# EAGLE design Logger (EAGLE 7.3.0)

## Sheet 1 of 6
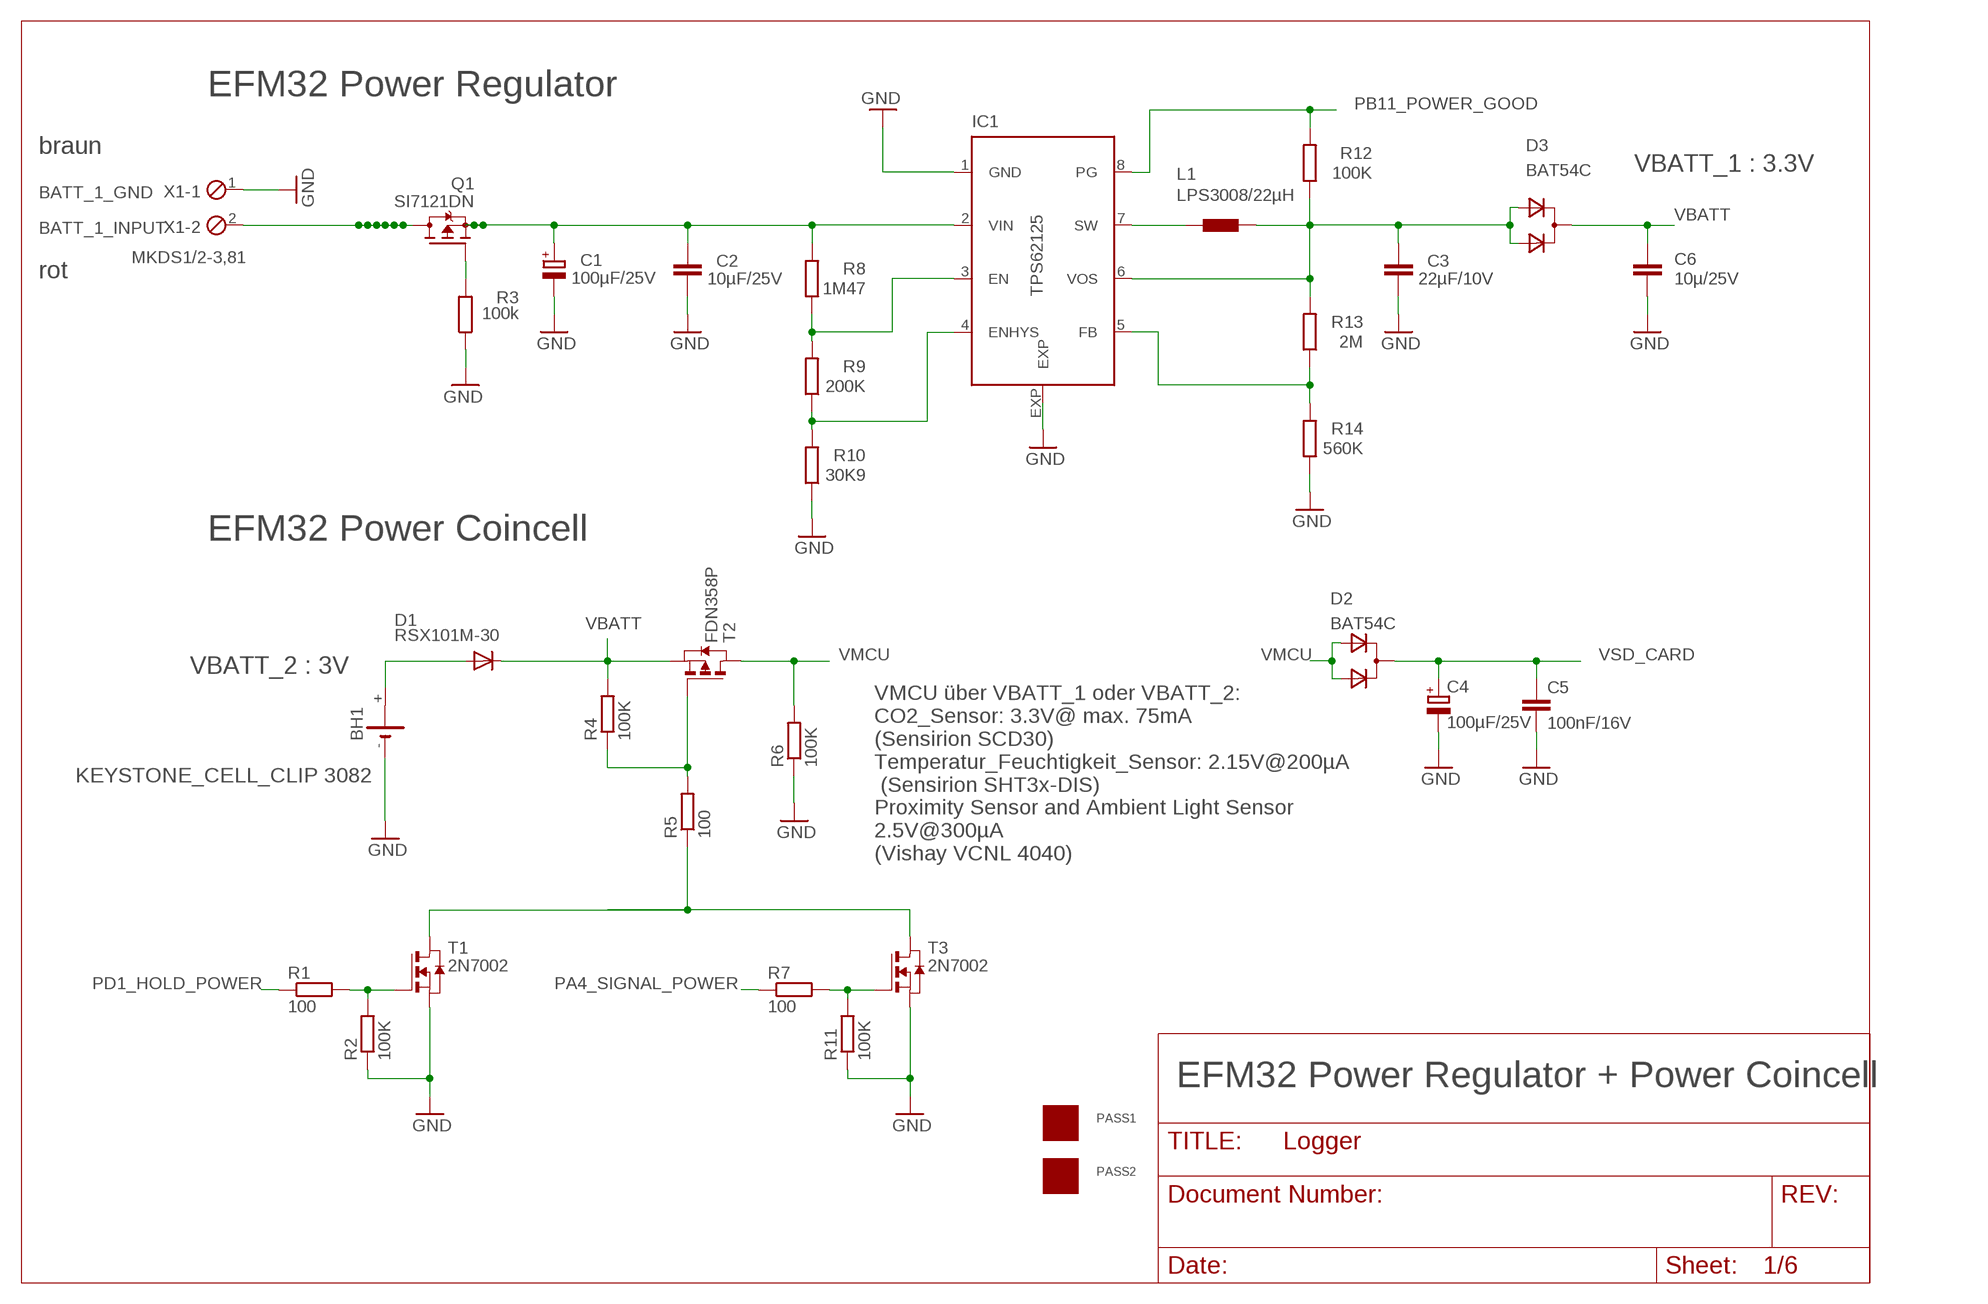
[diagram p0: schematic, sheet 1]

### Parts
BH1  KEYSTONE_CELL_CLIP 3082  3082  [3082]
C1  100µF/25V  CPOL-EUE  [PANASONIC_E]
C2  10µF/25V  C-EUC1206  [C1206]
C3  22µF/10V  C-EUC0603  [C0603]
C4  100µF/25V  CPOL-EUE  [PANASONIC_E]
C5  100nF/16V  C-EUC0805  [C0805]
C6  10µ/25V  C-EUC1206  [C1206]
D1  RSX101M-30  DIODE-SOD123  [SOD123]
D2  BAT54C  D2A_SOT23  [SOT-23$1]
D3  BAT54C  D2A_SOT23  [SOT-23$1]
IC1  TPS62125  [DSG_PWSO-N8_EXP]
L1  LPS3008/22µH  LPS3008  [LPS3008]
PASS1  ROUND_1MM1.5  [ROUND2_1.5MM]
PASS2  ROUND_1MM1.5  [ROUND2_1.5MM]
Q1  SI7121DN  TRANSISTOR-FET_SI7113DN  [TRANSISTOR-FET_1212-8S]
R1  100  R-EU_R0805  [R0805]
R2  100K  R-EU_R0805  [R0805]
R3  100k  R-EU_R0805  [R0805]
R4  100K  R-EU_R0805  [R0805]
R5  100  R-EU_R0805  [R0805]
R6  100K  R-EU_R0805  [R0805]
R7  100  R-EU_R0805  [R0805]
R8  1M47  R-EU_R0805  [R0805]
R9  200K  R-EU_R0805  [R0805]
R10  30K9  R-EU_R0805  [R0805]
R11  100K  R-EU_R0805  [R0805]
R12  100K  R-EU_R0805  [R0805]
R13  2M  R-EU_R0805  [R0805]
R14  560K  R-EU_R0805  [R0805]
T1  2N7002  NMOSSOT23  [SOT-23]
T2  FDN358P  ZETEX_PMOSSOT23  [ZETEX_SOT-23]
T3  2N7002  NMOSSOT23  [SOT-23]
X1  MKDS1/2-3,81  [2POL381]

### Nets
1: C3.1 D3.2(A1) D3.3(A2) IC1.6(VOS) L1.2 R12.1 R13.2
_: Q1.5(D) Q1.6(D) Q1.7(D) Q1.8(D) Q1.9(D) Q1.10(D) Q1.11(D) X1.2
BATT_INPUT: C1.+ C2.1 IC1.2(VIN) Q1.1(S) Q1.2(S) Q1.3(S) R8.2
GND: BH1.- C1.- C2.2 C3.2 C4.- C5.2 C6.1 IC1.1(GND) IC1.EXP R2.1 R3.1 R6.1 R10.1 R11.1 R14.1 T1.2(S) T3.2(S) X1.1 ; also sheet 2,3,4,5,6
N$2: R1.2 R2.2 T1.3(G)
N$5: IC1.3(EN) R8.1 R9.2
N$8: IC1.4(ENHYS) R9.1 R10.2
N$9: IC1.7(SW) L1.1
N$17: BH1.+ D1.A
N$20: Q1.4(G) R3.2
N$21: R4.1 R5.2 T2.3(G)
N$22: R7.2 R11.2 T3.3(G)
N$25: R5.1 T1.1(D) T3.1(D)
N$46: IC1.5(FB) R13.1 R14.2
PA4_SIGNAL_POWER: R7.1 ; also sheet 2,3
PB11_POWER_GOOD: IC1.8(PG) R12.2 ; also sheet 2
PD1_HOLD_POWER: R1.1 ; also sheet 2
VBATT: C6.2 D1.C D3.1(C) R4.2 T2.2(S) ; also sheet 3
VMCU: D2.2(A1) D2.3(A2) R6.2 T2.1(D) ; also sheet 2,3,5,6
VSD_CARD: C4.+ C5.1 D2.1(C) ; also sheet 4
Unconnected: BH1.+1(+)

### Notes on the sheet
- EFM32 Power Regulator
- braun
- VBATT_1 : 3.3V
- BATT_1_GND
- BATT_1_INPUT
- rot
- EFM32 Power Coincell
- VBATT_2 : 3V
- VMCU über VBATT_1 oder VBATT_2:
  CO2_Sensor: 3.3V@ max. 75mA
  (Sensirion SCD30)
  Temperatur_Feuchtigkeit_Sensor: 2.15V@200µA
   (Sensirion SHT3x-DIS)
  Proximity Sensor and Ambient Light Sensor
  2.5V@300µA
  (Vishay VCNL 4040)
- EFM32 Power Regulator + Power Coincell

## Sheet 2 of 6
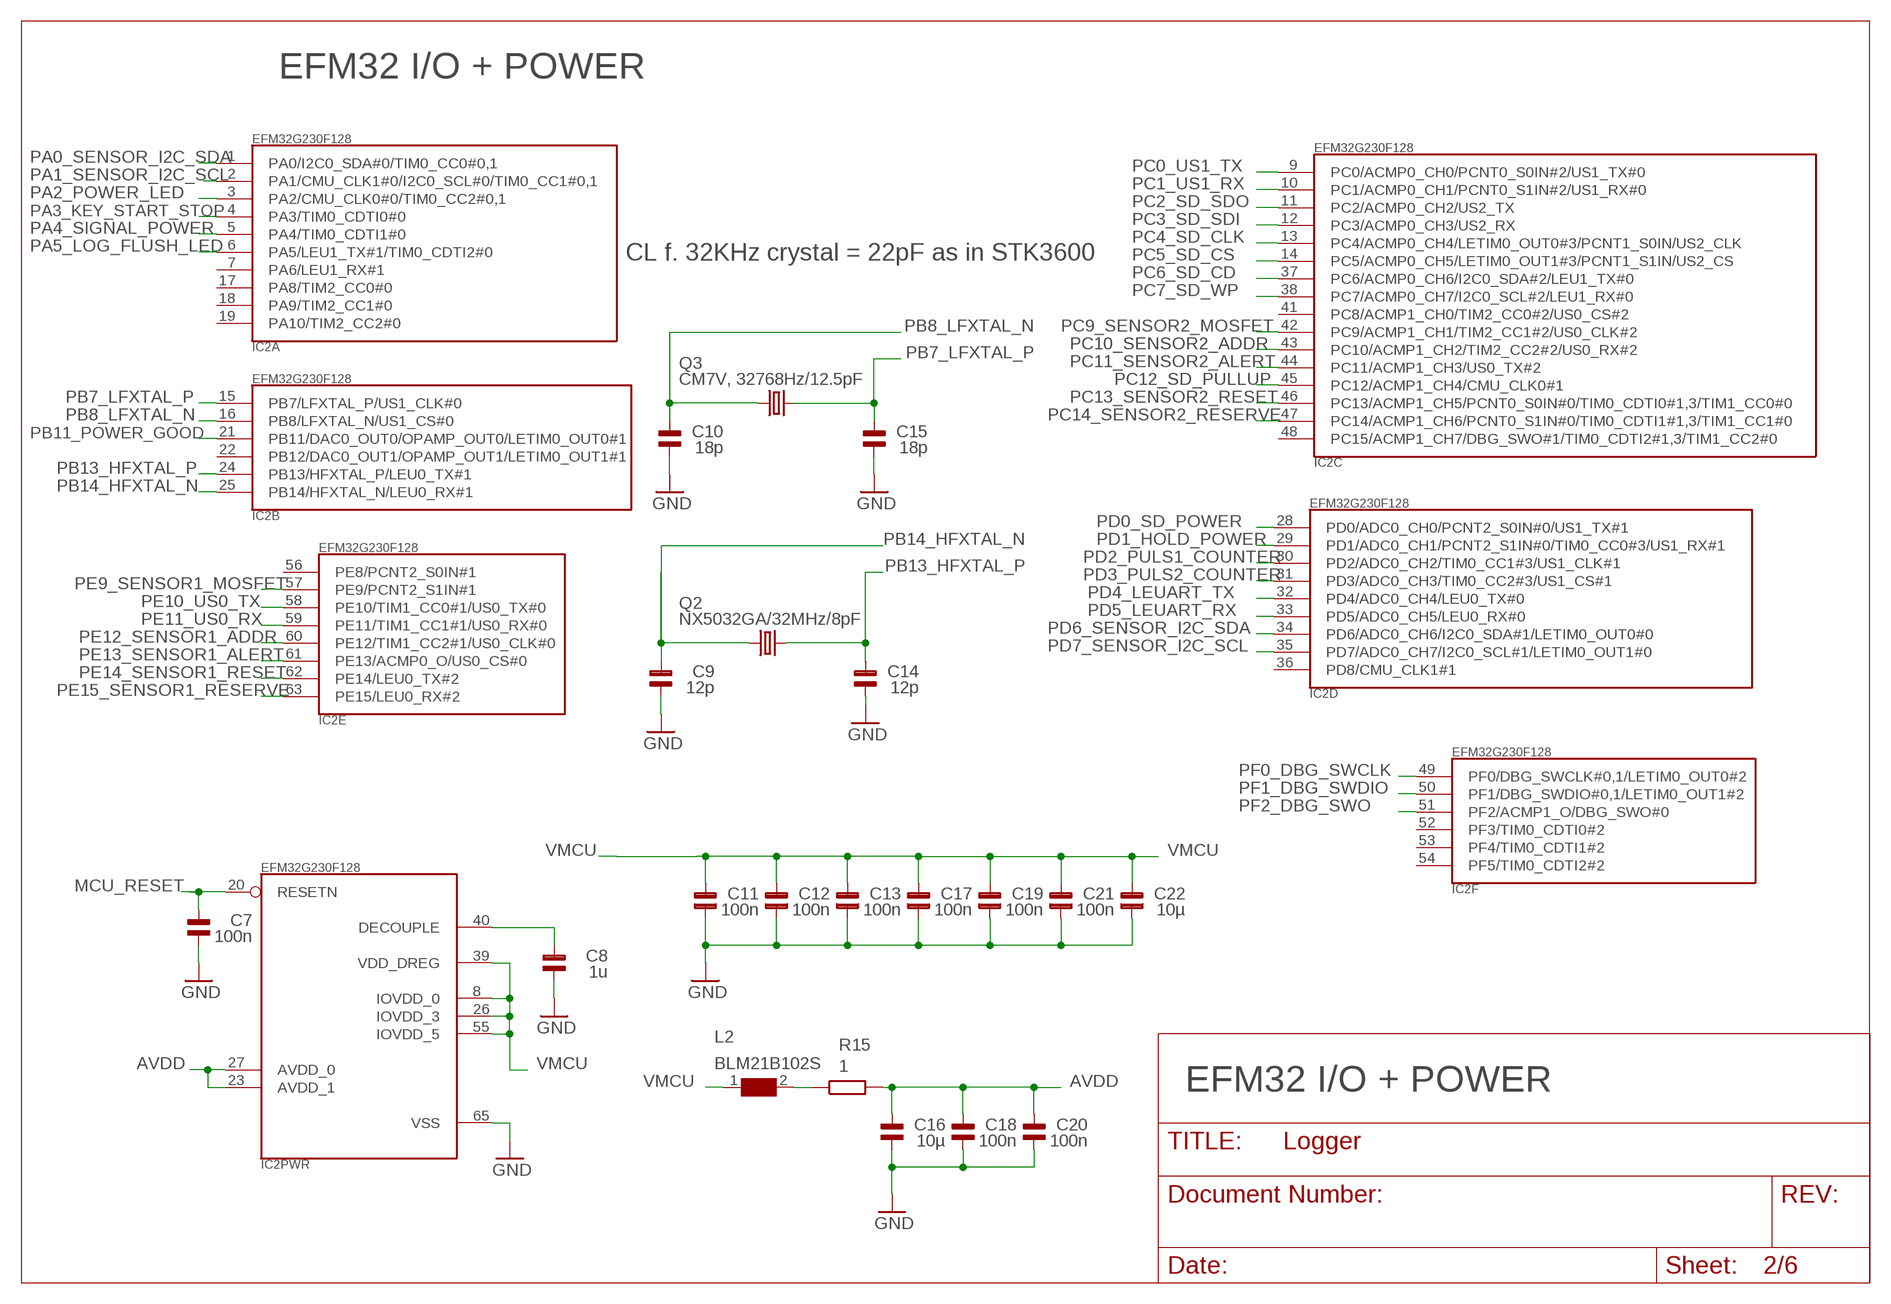
[diagram p1: schematic, sheet 2]

### Parts
C7  100n  C_SMD0805  [0805]
C8  1u  C_SMD0805  [0805]
C9  12p  C_SMD0805  [0805]
C10  18p  C_SMD0805  [0805]
C11  100n  C_SMD0805  [0805]
C12  100n  C_SMD0805  [0805]
C13  100n  C_SMD0805  [0805]
C14  12p  C_SMD0805  [0805]
C15  18p  C_SMD0805  [0805]
C16  10µ  C_SMD0805  [0805]
C17  100n  C_SMD0805  [0805]
C18  100n  C_SMD0805  [0805]
C19  100n  C_SMD0805  [0805]
C20  100n  C_SMD0805  [0805]
C21  100n  C_SMD0805  [0805]
C22  10µ  C_SMD0805  [0805]
IC2  EFM32G230F128  [QFN64]
L2  BLM21B102S  WE-CBF-7427920_0805  [0805]
Q2  NX5032GA/32MHz/8pF  CRYSTAL2P5.0X3.2  [CRYSTAL2P5.0X3.2]
Q3  CM7V, 32768Hz/12.5pF  CRYSTAL2P  [CRYSTAL2P3.2X1.5]
R15  1  R-EU_R0805  [R0805]

### Nets
AVDD [VCC]: C16.2 C18.2 C20.2 IC2.23(PWR:AVDD_1) IC2.27(PWR:AVDD_0) R15.2
GND: C7.1 C8.1 C9.1 C10.1 C11.1 C12.1 C13.1 C14.1 C15.1 C16.1 C17.1 C18.1 C19.1 C20.1 C21.1 C22.1 IC2.65(PWR:VSS) ; also sheet 1,3,4,5,6
MCU_RESET: C7.2 IC2.20(PWR:RESETN) ; also sheet 3
N$14: L2.2 R15.1
N$30: C8.2 IC2.40(PWR:DECOUPLE)
PA0_SENSOR_I2C_SDA: IC2.1(A:PA0/I2C0_SDA#0/TIM0_CC0#0,1) ; also sheet 5
PA1_SENSOR_I2C_SCL: IC2.2(A:PA1/CMU_CLK1#0/I2C0_SCL#0/TIM0_CC1#0,1) ; also sheet 5
PA2_POWER_LED: IC2.3(A:PA2/CMU_CLK0#0/TIM0_CC2#0,1) ; also sheet 3
PA3_KEY_START_STOP: IC2.4(A:PA3/TIM0_CDTI0#0) ; also sheet 3
PA4_SIGNAL_POWER: IC2.5(A:PA4/TIM0_CDTI1#0) ; also sheet 1,3
PA5_LOG_FLUSH_LED: IC2.6(A:PA5/LEU1_TX#1/TIM0_CDTI2#0) ; also sheet 3
PB7_LFXTAL_P: C15.2 IC2.15(B:PB7/LFXTAL_P/US1_CLK#0) Q3.2
PB8_LFXTAL_N: C10.2 IC2.16(B:PB8/LFXTAL_N/US1_CS#0) Q3.1
PB11_POWER_GOOD: IC2.21(B:PB11/DAC0_OUT0/OPAMP_OUT0/LETIM0_OUT0#1) ; also sheet 1
PB13_HFXTAL_P: C14.2 IC2.24(B:PB13/HFXTAL_P/LEU0_TX#1) Q2.2
PB14_HFXTAL_N: C9.2 IC2.25(B:PB14/HFXTAL_N/LEU0_RX#1) Q2.1
PC0_US1_TX: IC2.9(C:PC0/ACMP0_CH0/PCNT0_S0IN#2/US1_TX#0) ; also sheet 4
PC1_US1_RX: IC2.10(C:PC1/ACMP0_CH1/PCNT0_S1IN#2/US1_RX#0) ; also sheet 4
PC2_SD_SDO: IC2.11(C:PC2/ACMP0_CH2/US2_TX) ; also sheet 4
PC3_SD_SDI: IC2.12(C:PC3/ACMP0_CH3/US2_RX) ; also sheet 4
PC4_SD_CLK: IC2.13(C:PC4/ACMP0_CH4/LETIM0_OUT0#3/PCNT1_S0IN/US2_CLK) ; also sheet 4
PC5_SD_CS: IC2.14(C:PC5/ACMP0_CH5/LETIM0_OUT1#3/PCNT1_S1IN/US2_CS) ; also sheet 4
PC6_SD_CD: IC2.37(C:PC6/ACMP0_CH6/I2C0_SDA#2/LEU1_TX#0) ; also sheet 4
PC7_SD_WP: IC2.38(C:PC7/ACMP0_CH7/I2C0_SCL#2/LEU1_RX#0) ; also sheet 4
PC9_SENSOR2_MOSFET: IC2.42(C:PC9/ACMP1_CH1/TIM2_CC1#2/US0_CLK#2) ; also sheet 5
PC10_SENSOR2_ADDR: IC2.43(C:PC10/ACMP1_CH2/TIM2_CC2#2/US0_RX#2) ; also sheet 5
PC11_SENSOR2_ALERT: IC2.44(C:PC11/ACMP1_CH3/US0_TX#2) ; also sheet 5
PC12_SD_PULLUP: IC2.45(C:PC12/ACMP1_CH4/CMU_CLK0#1) ; also sheet 4
PC13_SENSOR2_RESET: IC2.46(C:PC13/ACMP1_CH5/PCNT0_S0IN#0/TIM0_CDTI0#1,3/TIM1_CC0#0) ; also sheet 5
PC14_SENSOR2_RESERVE: IC2.47(C:PC14/ACMP1_CH6/PCNT0_S1IN#0/TIM0_CDTI1#1,3/TIM1_CC1#0) ; also sheet 5
PD0_SD_POWER: IC2.28(D:PD0/ADC0_CH0/PCNT2_S0IN#0/US1_TX#1) ; also sheet 4
PD1_HOLD_POWER: IC2.29(D:PD1/ADC0_CH1/PCNT2_S1IN#0/TIM0_CC0#3/US1_RX#1) ; also sheet 1
PD2_PULS1_COUNTER: IC2.30(D:PD2/ADC0_CH2/TIM0_CC1#3/US1_CLK#1) ; also sheet 6
PD3_PULS2_COUNTER: IC2.31(D:PD3/ADC0_CH3/TIM0_CC2#3/US1_CS#1) ; also sheet 6
PD4_LEUART_TX: IC2.32(D:PD4/ADC0_CH4/LEU0_TX#0) ; also sheet 4
PD5_LEUART_RX: IC2.33(D:PD5/ADC0_CH5/LEU0_RX#0) ; also sheet 4
PD6_SENSOR_I2C_SDA: IC2.34(D:PD6/ADC0_CH6/I2C0_SDA#1/LETIM0_OUT0#0) ; also sheet 5
PD7_SENSOR_I2C_SCL: IC2.35(D:PD7/ADC0_CH7/I2C0_SCL#1/LETIM0_OUT1#0) ; also sheet 5
PE9_SENSOR1_MOSFET: IC2.57(E:PE9/PCNT2_S1IN#1) ; also sheet 5
PE10_US0_TX: IC2.58(E:PE10/TIM1_CC0#1/US0_TX#0) ; also sheet 4
PE11_US0_RX: IC2.59(E:PE11/TIM1_CC1#1/US0_RX#0) ; also sheet 4
PE12_SENSOR1_ADDR: IC2.60(E:PE12/TIM1_CC2#1/US0_CLK#0) ; also sheet 5
PE13_SENSOR1_ALERT: IC2.61(E:PE13/ACMP0_O/US0_CS#0) ; also sheet 5
PE14_SENSOR1_RESET: IC2.62(E:PE14/LEU0_TX#2) ; also sheet 5
PE15_SENSOR1_RESERVE: IC2.63(E:PE15/LEU0_RX#2) ; also sheet 5
PF0_DBG_SWCLK: IC2.49(F:PF0/DBG_SWCLK#0,1/LETIM0_OUT0#2) ; also sheet 3
PF1_DBG_SWDIO: IC2.50(F:PF1/DBG_SWDIO#0,1/LETIM0_OUT1#2) ; also sheet 3
PF2_DBG_SWO: IC2.51(F:PF2/ACMP1_O/DBG_SWO#0) ; also sheet 3
VMCU: C11.2 C12.2 C13.2 C17.2 C19.2 C21.2 C22.2 IC2.8(PWR:IOVDD_0) IC2.26(PWR:IOVDD_3) IC2.39(PWR:VDD_DREG) IC2.55(PWR:IOVDD_5) L2.1 ; also sheet 1,3,5,6
Unconnected: IC2.7(A:PA6/LEU1_RX#1) IC2.17(A:PA8/TIM2_CC0#0) IC2.18(A:PA9/TIM2_CC1#0) IC2.19(A:PA10/TIM2_CC2#0) IC2.22(B:PB12/DAC0_OUT1/OPAMP_OUT1/LETIM0_OUT1#1) IC2.36(D:PD8/CMU_CLK1#1) IC2.41(C:PC8/ACMP1_CH0/TIM2_CC0#2/US0_CS#2) IC2.48(C:PC15/ACMP1_CH7/DBG_SWO#1/TIM0_CDTI2#1,3/TIM1_CC2#0) IC2.52(F:PF3/TIM0_CDTI0#2) IC2.53(F:PF4/TIM0_CDTI1#2) IC2.54(F:PF5/TIM0_CDTI2#2) IC2.56(E:PE8/PCNT2_S0IN#1)

### Notes on the sheet
- EFM32 I/O + POWER
- CL f. 32KHz crystal = 22pF as in STK3600
- EFM32 I/O + POWER

## Sheet 3 of 6
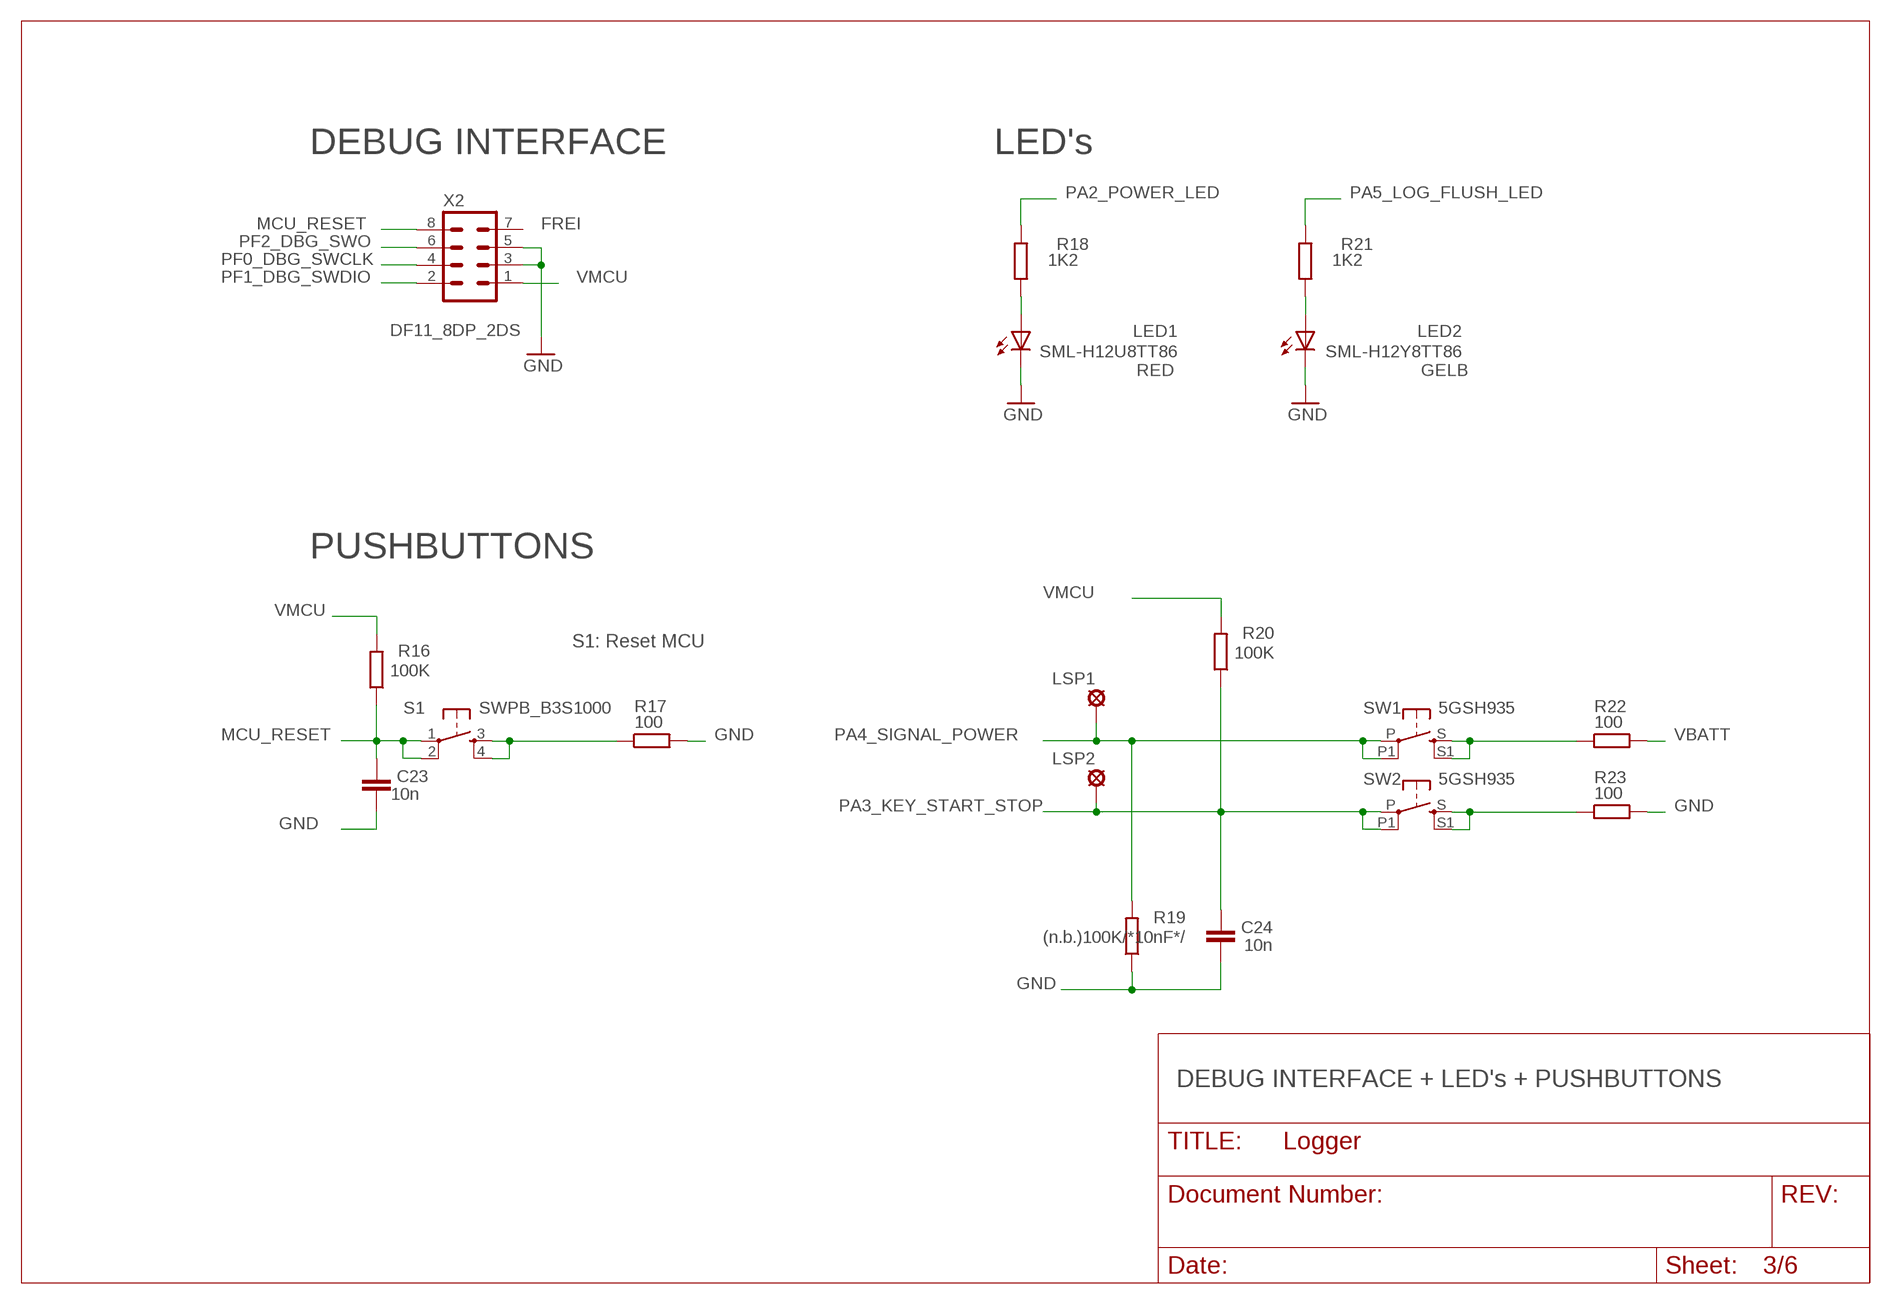
[diagram p2: schematic, sheet 3]

### Parts
C23  10n  C-EUC0603  [C0603]
C24  10n  C-EUC0603K  [C0603K]
LED1  SML-H12U8TT86  LEDCHIPLED_0805  [CHIPLED_0805]
LED2  SML-H12Y8TT86  LEDCHIPLED_0805  [CHIPLED_0805]
LSP1  (n.b.)SE13  SE13  [SE13]
LSP2  (n.b.)SE13  SE13  [SE13]
R16  100K  R-EU_R0805  [R0805]
R17  100  R-EU_R0805  [R0805]
R18  1K2  R-EU_R0805  [R0805]
R19  (n.b.)100K/*10nF*/  R-EU_R0805  [R0805]
R20  100K  R-EU_R0805  [R0805]
R21  1K2  R-EU_R0805  [R0805]
R22  100  R-EU_R0805  [R0805]
R23  100  R-EU_R0805  [R0805]
S1  SWPB_B3S1000  DTSM-6  [DTSM-6]
SW1  5GSH935  [MULTIMEC_5GSH935]
SW2  5GSH935  [MULTIMEC_5GSH935]
X2  DF11_8DP_2DS  DP11_8DP_2DS  [DP11_8DP-2DS]

### Nets
GND: C23.1 C24.1 LED1.C LED2.C R17.2 R19.1 R23.2 X2.3 X2.5 ; also sheet 1,2,4,5,6
MCU_RESET: C23.2 R16.1 S1.1 S1.2 X2.8 ; also sheet 2
N$15: LED1.A R18.2
N$16: LED2.A R21.2
N$26: R17.1 S1.3 S1.4
N$27: R23.1 SW2.S SW2.S1
N$29: R22.1 SW1.S SW1.S1
PA2_POWER_LED: R18.1 ; also sheet 2
PA3_KEY_START_STOP: C24.2 LSP2.MP R20.1 SW2.P SW2.P1 ; also sheet 2
PA4_SIGNAL_POWER: LSP1.MP R19.2 SW1.P SW1.P1 ; also sheet 1,2
PA5_LOG_FLUSH_LED: R21.1 ; also sheet 2
PF0_DBG_SWCLK: X2.4 ; also sheet 2
PF1_DBG_SWDIO: X2.2 ; also sheet 2
PF2_DBG_SWO: X2.6 ; also sheet 2
VBATT: R22.2 ; also sheet 1
VMCU: R16.2 R20.2 X2.1 ; also sheet 1,2,5,6
Unconnected: X2.7

### Notes on the sheet
- DEBUG INTERFACE | LED's
- FREI
- RED | GELB
- PUSHBUTTONS
- S1: Reset MCU
- DEBUG INTERFACE + LED's + PUSHBUTTONS

## Sheet 4 of 6
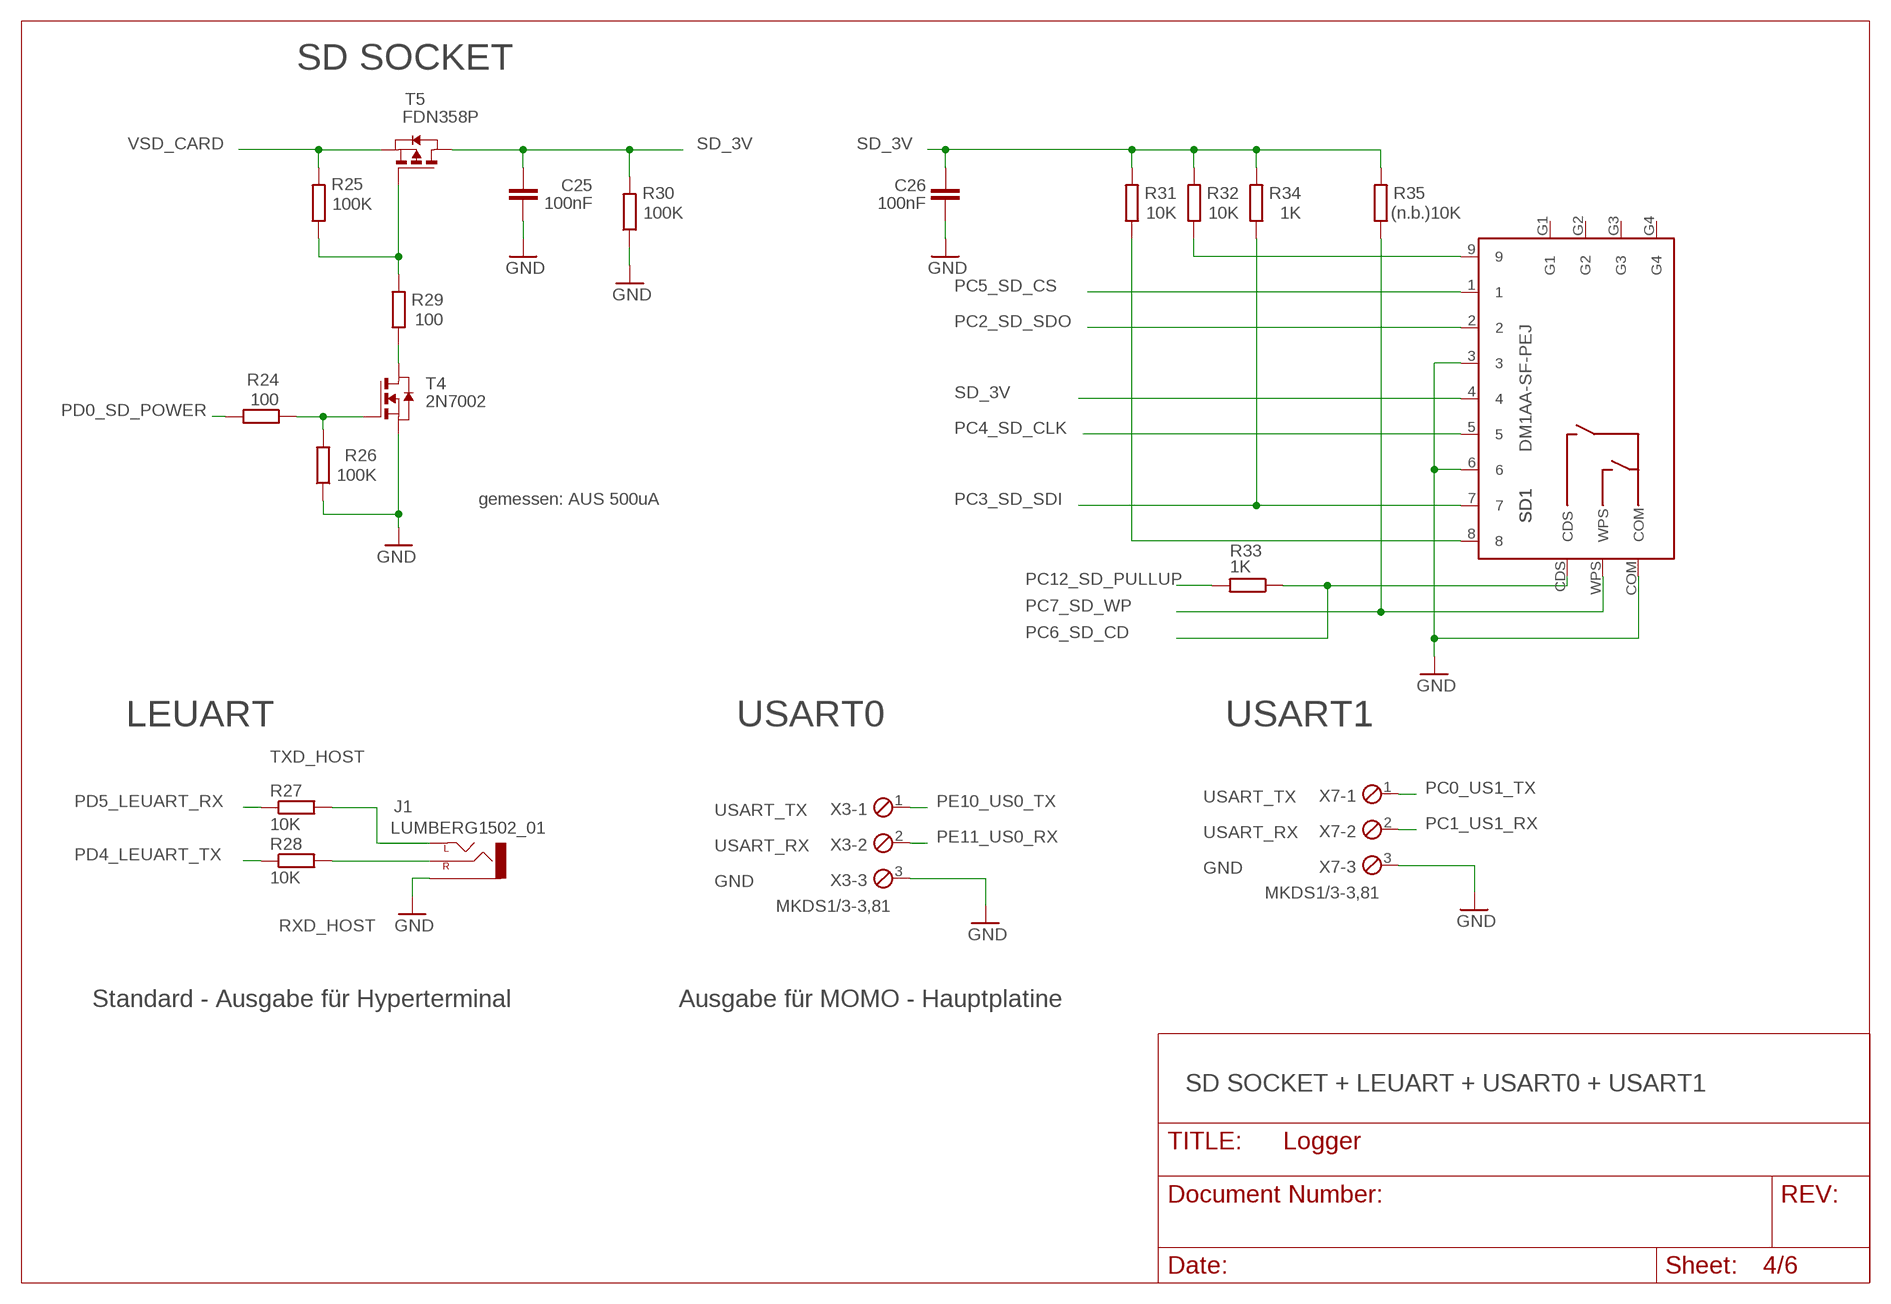
[diagram p3: schematic, sheet 4]

### Parts
C25  100nF  C-EUC0603  [C0603]
C26  100nF  C-EUC0603  [C0603]
J1  LUMBERG1502_01  [LUMBERG1502_01]
R24  100  R-EU_R0805  [R0805]
R25  100K  R-EU_R0805  [R0805]
R26  100K  R-EU_R0805  [R0805]
R27  10K  R-EU_R0805  [R0805]
R28  10K  R-EU_R0805  [R0805]
R29  100  R-EU_R0805  [R0805]
R30  100K  R-EU_R0805  [R0805]
R31  10K  R-EU_R0805  [R0805]
R32  10K  R-EU_R0805  [R0805]
R33  1K  R-EU_R0805  [R0805]
R34  1K  R-EU_R0805  [R0805]
R35  (n.b.)10K  R-EU_R0805  [R0805]
SD1  DM1AA-SF-PEJ  [DM1AA-SF-PEJ]
T4  2N7002  ZETEX_NMOSSOT23  [ZETEX_SOT-23]
T5  FDN358P  ZETEX_PMOSSOT23  [ZETEX_SOT-23]
X3  MKDS1/3-3,81  [3POL381]
X7  MKDS1/3-3,81  [3POL381]

### Nets
GND: C25.2 C26.2 J1.P$1(1-SLEEVE) R26.1 R30.1 SD1.3 SD1.6 SD1.COM T4.2(S) X3.3 X7.3 ; also sheet 1,2,3,5,6
N$4: R25.1 R29.2 T5.3(G)
N$6: R29.1 T4.1(D)
N$7: R24.1 R26.2 T4.3(G)
N$19: R32.1 SD1.9
N$23: R31.1 SD1.8
PC0_US1_TX: X7.1 ; also sheet 2
PC1_US1_RX: X7.2 ; also sheet 2
PC2_SD_SDO: SD1.2 ; also sheet 2
PC3_SD_SDI: R34.1 SD1.7 ; also sheet 2
PC4_SD_CLK: SD1.5 ; also sheet 2
PC5_SD_CS: SD1.1 ; also sheet 2
PC6_SD_CD: R33.1 SD1.CDS ; also sheet 2
PC7_SD_WP: R35.1 SD1.WPS ; also sheet 2
PC12_SD_PULLUP: R33.2 ; also sheet 2
PD0_SD_POWER: R24.2 ; also sheet 2
PD4_LEUART_TX: R28.1 ; also sheet 2
PD5_LEUART_RX: R27.1 ; also sheet 2
PE10_US0_TX: X3.1 ; also sheet 2
PE11_US0_RX: X3.2 ; also sheet 2
RXD_HOST: J1.P$3(3-RIGHT) R28.2
SD_3V: C25.1 C26.1 R30.2 R31.2 R32.2 R34.2 R35.2 SD1.4 T5.1(D)
TXD_HOST: J1.P$2(2-LEFT) R27.2
VSD_CARD: R25.2 T5.2(S) ; also sheet 1
Unconnected: SD1.G1 SD1.G2 SD1.G3 SD1.G4

### Notes on the sheet
- SD SOCKET
- gemessen: AUS 500uA
- LEUART | USART0 | USART1
- USART_TX
- USART_TX
- USART_RX
- USART_RX
- GND
- GND
- Standard - Ausgabe für Hyperterminal | Ausgabe für MOMO - Hauptplatine
- SD SOCKET + LEUART + USART0 + USART1

## Sheet 5 of 6
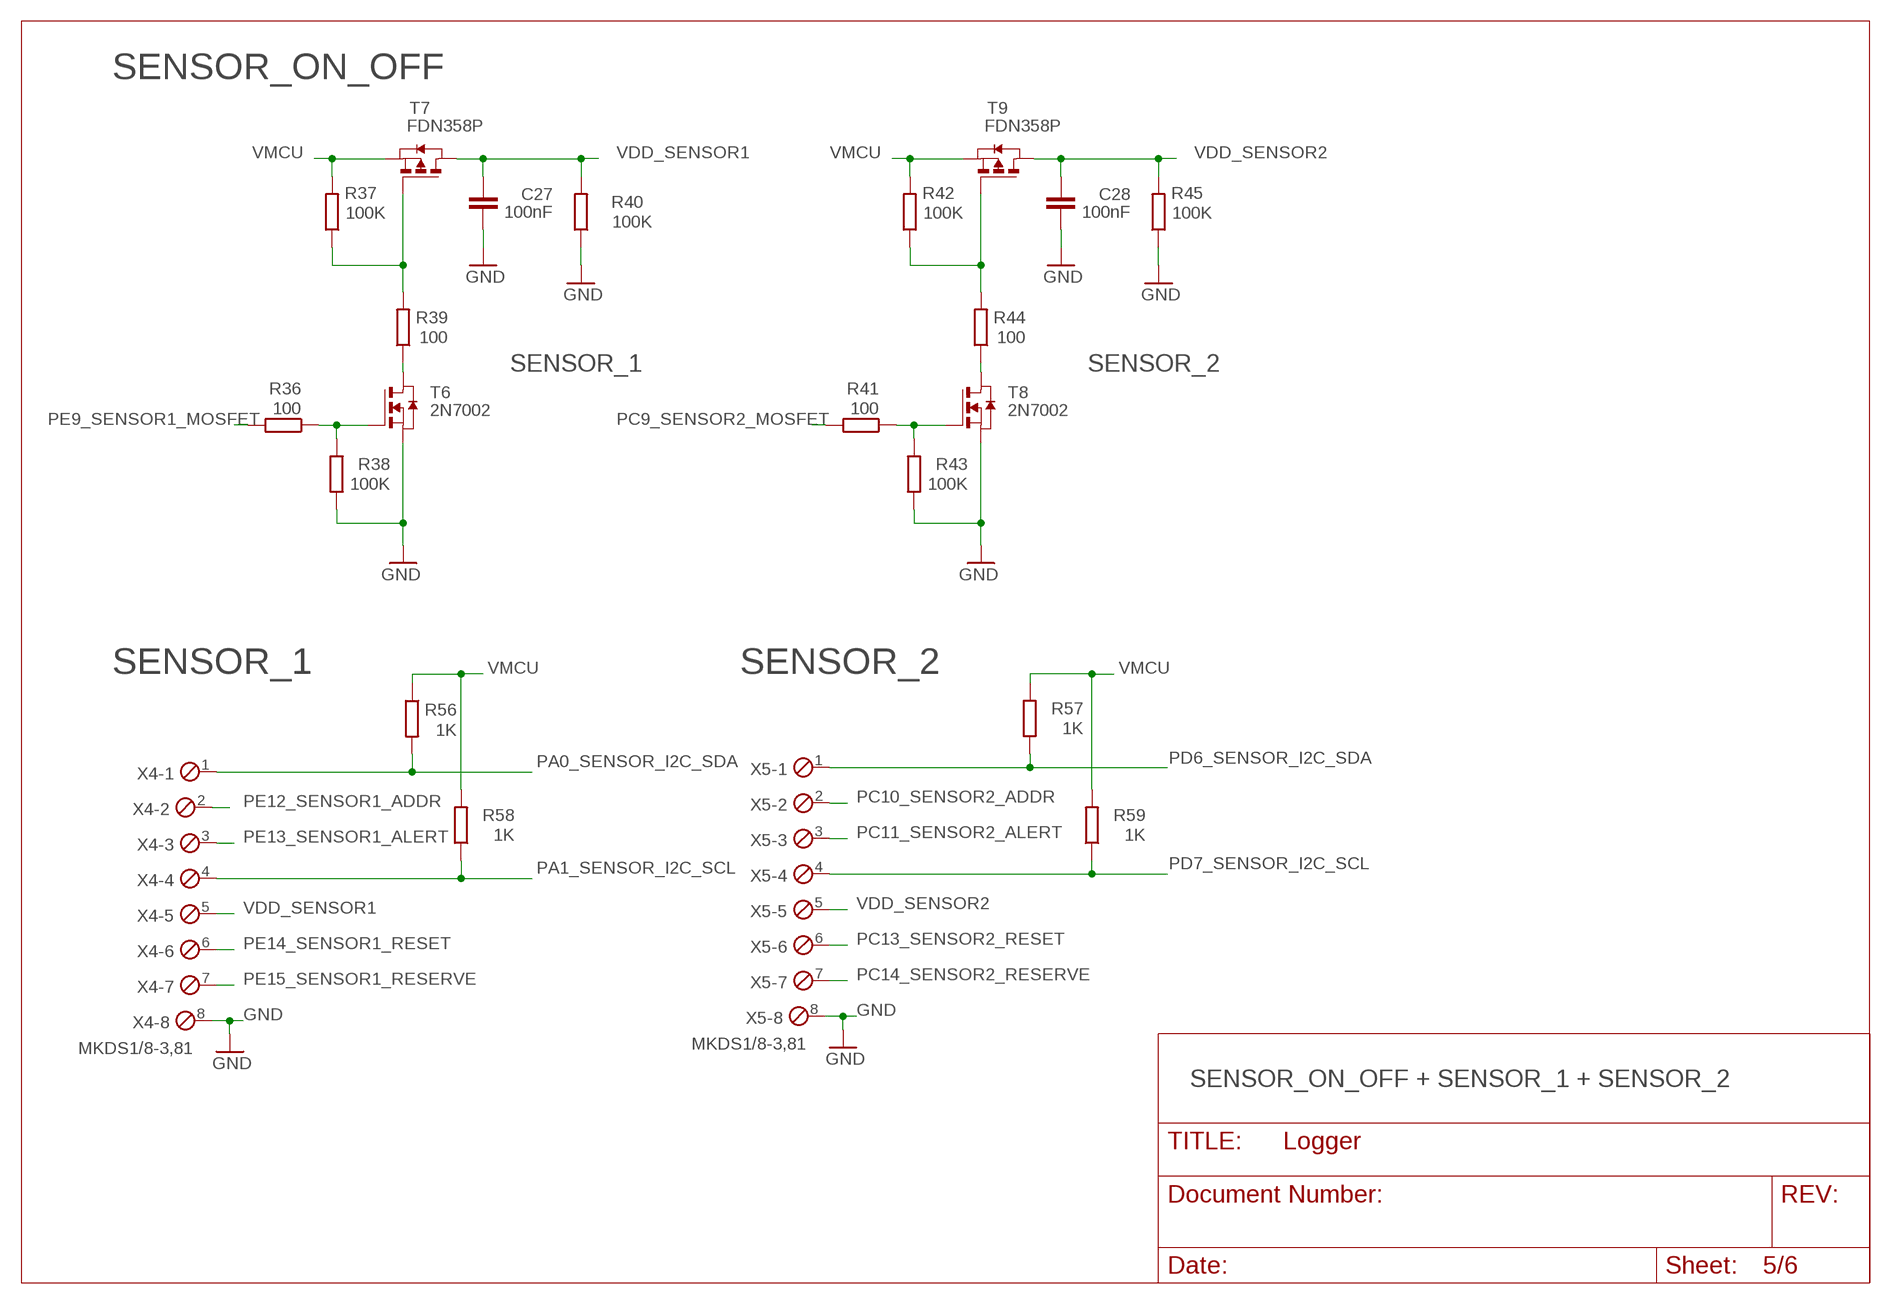
[diagram p4: schematic, sheet 5]

### Parts
C27  100nF  C-EUC0603  [C0603]
C28  100nF  C-EUC0603  [C0603]
R36  100  R-EU_R0805  [R0805]
R37  100K  R-EU_R0805  [R0805]
R38  100K  R-EU_R0805  [R0805]
R39  100  R-EU_R0805  [R0805]
R40  100K  R-EU_R0805  [R0805]
R41  100  R-EU_R0805  [R0805]
R42  100K  R-EU_R0805  [R0805]
R43  100K  R-EU_R0805  [R0805]
R44  100  R-EU_R0805  [R0805]
R45  100K  R-EU_R0805  [R0805]
R56  1K  R-EU_R0805  [R0805]
R57  1K  R-EU_R0805  [R0805]
R58  1K  R-EU_R0805  [R0805]
R59  1K  R-EU_R0805  [R0805]
T6  2N7002  ZETEX_NMOSSOT23  [ZETEX_SOT-23]
T7  FDN358P  ZETEX_PMOSSOT23  [ZETEX_SOT-23]
T8  2N7002  ZETEX_NMOSSOT23  [ZETEX_SOT-23]
T9  FDN358P  ZETEX_PMOSSOT23  [ZETEX_SOT-23]
X4  MKDS1/8-3,81  [8POL381]
X5  MKDS1/8-3,81  [8POL381]

### Nets
GND: C27.2 C28.2 R38.1 R40.1 R43.1 R45.1 T6.2(S) T8.2(S) X4.8 X5.8 ; also sheet 1,2,3,4,6
N$3: R37.1 R39.2 T7.3(G)
N$10: R39.1 T6.1(D)
N$11: R36.1 R38.2 T6.3(G)
N$12: R42.1 R44.2 T9.3(G)
N$13: R44.1 T8.1(D)
N$18: R41.1 R43.2 T8.3(G)
PA0_SENSOR_I2C_SDA: R56.2 X4.1 ; also sheet 2
PA1_SENSOR_I2C_SCL: R58.1 X4.4 ; also sheet 2
PC9_SENSOR2_MOSFET: R41.2 ; also sheet 2
PC10_SENSOR2_ADDR: X5.2 ; also sheet 2
PC11_SENSOR2_ALERT: X5.3 ; also sheet 2
PC13_SENSOR2_RESET: X5.6 ; also sheet 2
PC14_SENSOR2_RESERVE: X5.7 ; also sheet 2
PD6_SENSOR_I2C_SDA: R57.1 X5.1 ; also sheet 2
PD7_SENSOR_I2C_SCL: R59.1 X5.4 ; also sheet 2
PE9_SENSOR1_MOSFET: R36.2 ; also sheet 2
PE12_SENSOR1_ADDR: X4.2 ; also sheet 2
PE13_SENSOR1_ALERT: X4.3 ; also sheet 2
PE14_SENSOR1_RESET: X4.6 ; also sheet 2
PE15_SENSOR1_RESERVE: X4.7 ; also sheet 2
VDD_SENSOR1: C27.1 R40.2 T7.1(D) X4.5
VDD_SENSOR2: C28.1 R45.2 T9.1(D) X5.5
VMCU: R37.2 R42.2 R56.1 R57.2 R58.2 R59.2 T7.2(S) T9.2(S) ; also sheet 1,2,3,6

### Notes on the sheet
- SENSOR_ON_OFF
- SENSOR_1 | SENSOR_2
- SENSOR_1 | SENSOR_2
- SENSOR_ON_OFF + SENSOR_1 + SENSOR_2

## Sheet 6 of 6
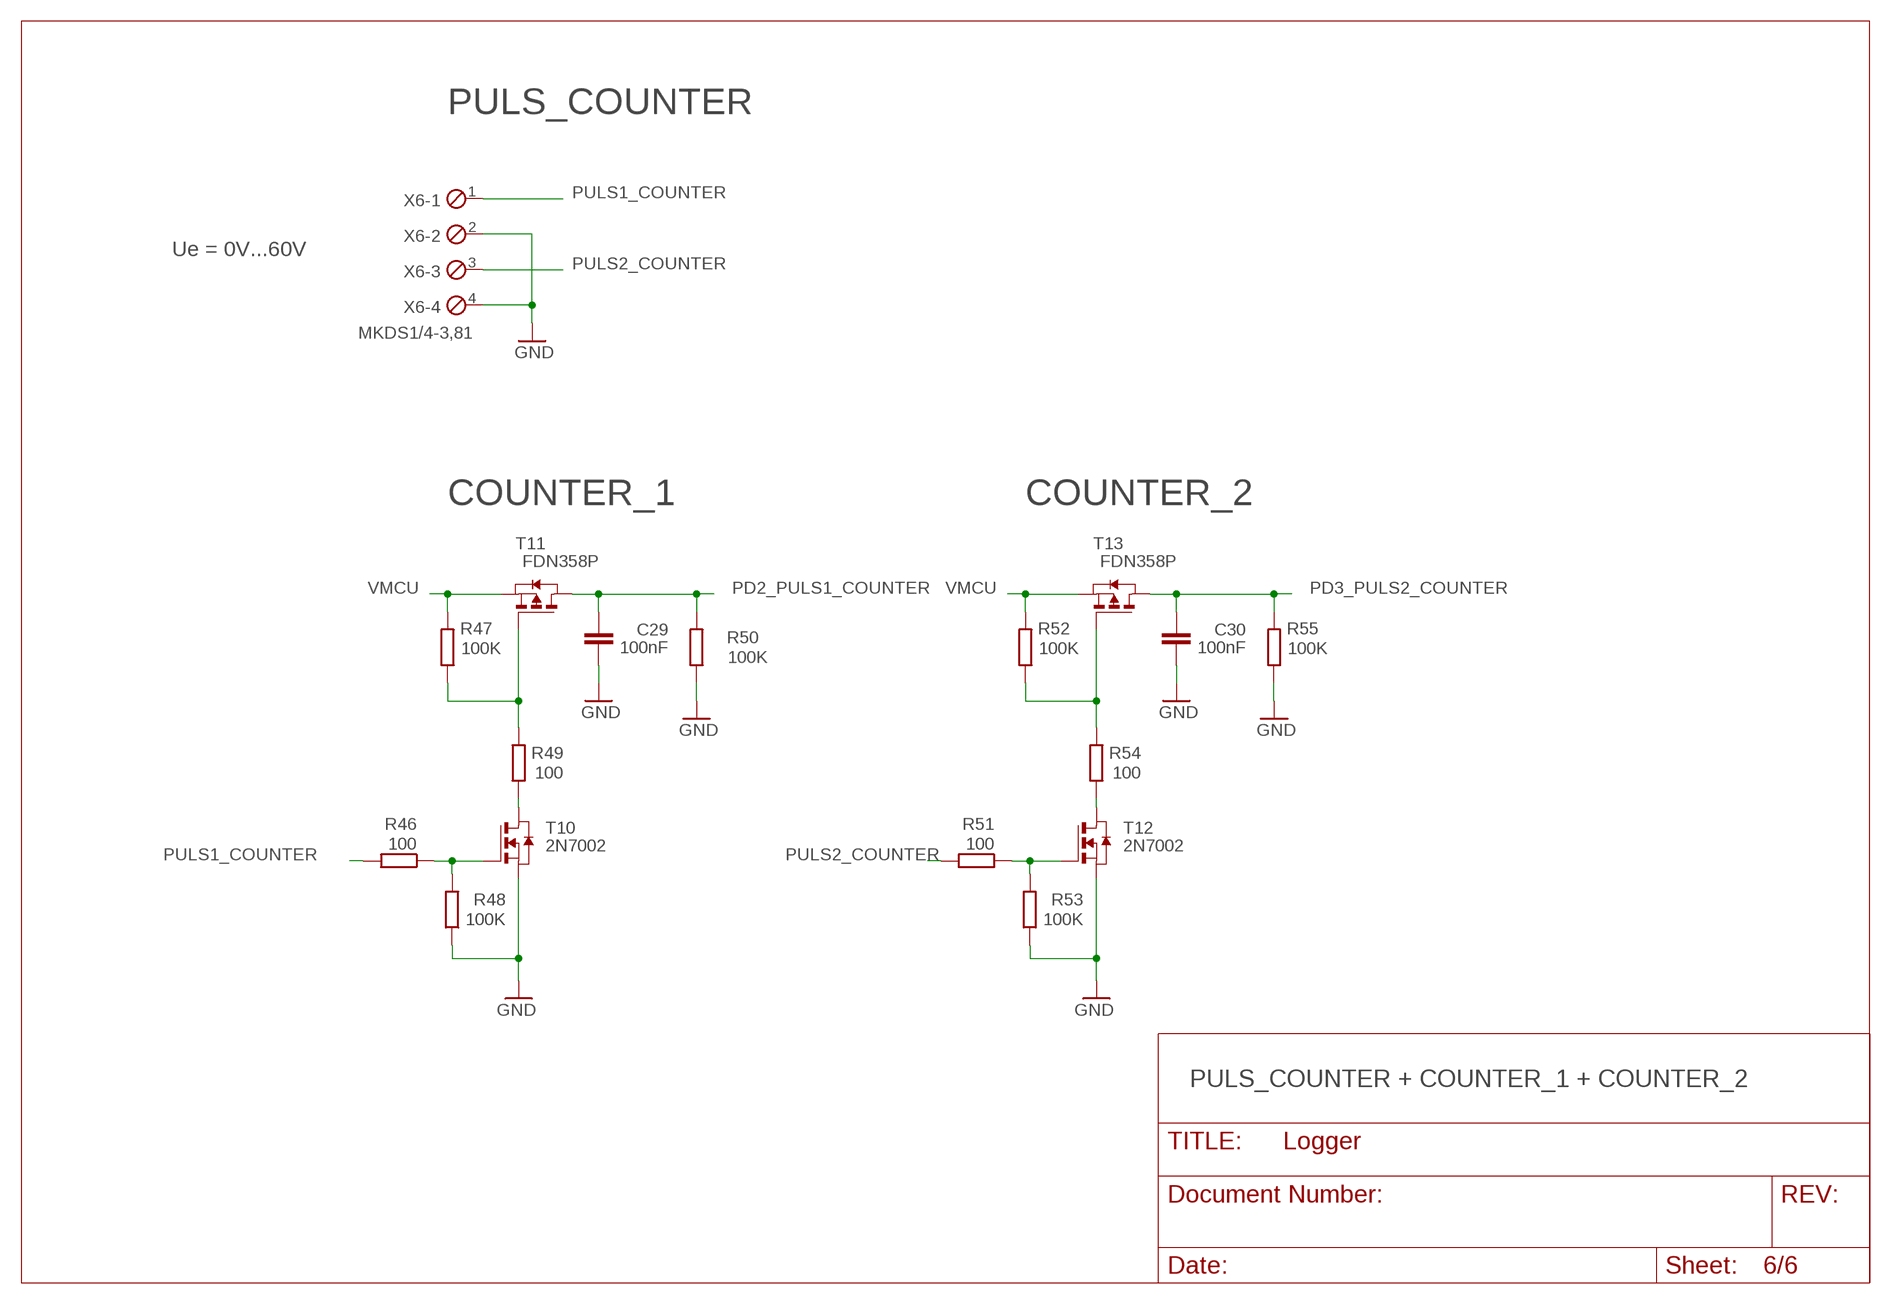
[diagram p5: schematic, sheet 6]

### Parts
C29  100nF  C-EUC0603  [C0603]
C30  100nF  C-EUC0603  [C0603]
R46  100  R-EU_R0805  [R0805]
R47  100K  R-EU_R0805  [R0805]
R48  100K  R-EU_R0805  [R0805]
R49  100  R-EU_R0805  [R0805]
R50  100K  R-EU_R0805  [R0805]
R51  100  R-EU_R0805  [R0805]
R52  100K  R-EU_R0805  [R0805]
R53  100K  R-EU_R0805  [R0805]
R54  100  R-EU_R0805  [R0805]
R55  100K  R-EU_R0805  [R0805]
T10  2N7002  ZETEX_NMOSSOT23  [ZETEX_SOT-23]
T11  FDN358P  ZETEX_PMOSSOT23  [ZETEX_SOT-23]
T12  2N7002  ZETEX_NMOSSOT23  [ZETEX_SOT-23]
T13  FDN358P  ZETEX_PMOSSOT23  [ZETEX_SOT-23]
X6  MKDS1/4-3,81  [4POL381]

### Nets
GND: C29.2 C30.2 R48.1 R50.1 R53.1 R55.1 T10.2(S) T12.2(S) X6.2 X6.4 ; also sheet 1,2,3,4,5
N$24: R47.1 R49.2 T11.3(G)
N$28: R49.1 T10.1(D)
N$31: R46.1 R48.2 T10.3(G)
N$32: R52.1 R54.2 T13.3(G)
N$33: R54.1 T12.1(D)
N$34: R51.1 R53.2 T12.3(G)
PD2_PULS1_COUNTER: C29.1 R50.2 T11.1(D) ; also sheet 2
PD3_PULS2_COUNTER: C30.1 R55.2 T13.1(D) ; also sheet 2
PULS1_COUNTER: R46.2 X6.1
PULS2_COUNTER: R51.2 X6.3
VMCU: R47.2 R52.2 T11.2(S) T13.2(S) ; also sheet 1,2,3,5

### Notes on the sheet
- PULS_COUNTER
- Ue = 0V...60V
- COUNTER_1 | COUNTER_2
- PULS_COUNTER + COUNTER_1 + COUNTER_2

## Library data of the parts
BH1 = battery:3082
C1 C4 = resistor:CPOL-EU: POLARIZED CAPACITOR, European symbol
C2 C3 C5 C6 C24 = rcl:C-EU: CAPACITOR, European symbol
C7-C22 = IAR.RLC:C_SMD
C23 C25-C30 = resistor:C-EU: CAPACITOR, European symbol
D1 = diode:DIODE-: DIODE
D2 D3 = zetex:D2A_SOT23: Dual DIODE
IC1 = texas_Kiermaier:TPS62125
IC2 = EnergyMicro:EFM32G230F128: EFM32G230F128 Gecko Microcontroller in 9mm x 9mm QFN64 package
J1 = EdM 2011:LUMBERG1502_01
L1 = inductors:LPS3008
L2 = WE-CBF:WE-CBF: SMD EMI Suppression Ferrite Beads WE-CBF - Excellent anti-EMI properties - Low DC-restistance - Impedances till 3000 ohms - Rated current up to 6 A -- Reliable Ni-Sn electrodes -- Perfect as data lined filter and for uncoupling of distribution voltage; MPN: 7427920; OC_FARNELL: 1635707; OC_NEWARK: 08P2358; PACKAGE: IND-0805; SUPPLIER: Wuerth Elektronik
LED1 LED2 = led:LED: LED OSRAM: - CHIPLED LG R971, LG N971, LY N971, LG Q971, LY Q971, LO R971, LY R971 LH N974, LH R974 LS Q976, LO Q976, LY Q976 LO Q996 - Hyper CHIPLED LW Q18S LB Q993, LB Q99A, LB R99A - SideLED LS A670, LO A670, LY A670, LG A670, LP A670 LB A673, LV A673, LT A673, LW A673 LH A674 LY A675 LS A676, LA A676, LO A676, LY A676, LW A676 LS A679, LY A679, LG A679 - Hyper Micro SIDELED® LS Y876, LA Y876, LO Y876, LY Y876 LT Y87S - SmartLED LW L88C, LW L88S LB L89C, LB L89S, LG L890 LS L89K, LO L89K, LY L89K LS L896, LA L896, LO L896, LY L896 - TOPLED LS T670, LO T670, LY T670, LG T670, LP T670 LSG T670, LSP T670, LSY T670, LOP T670, LYG T670 LG T671, LOG T671, LSG T671 LB T673, LV T673, LT T673, LW T673 LH T674 LS T676, LA T676, LO T676, LY T676, LB T676, LH T676, LSB T676, LW T676 LB T67C, LV T67C, LT T67C, LS T67K, LO T67K, LY T67K, LW E67C LS E67B, LA E67B, LO E67B, LY E67B, LB E67C, LV E67C, LT E67C LW T67C LS T679, LY T679, LG T679 LS T770, LO T770, LY T770, LG T770, LP T770 LB T773, LV T773, LT T773, LW T773 LH T774 LS E675, LA E675, LY E675, LS T675 LS T776, LA T776, LO T776, LY T776, LB T776 LHGB T686 LT T68C, LB T68C - Hyper Mini TOPLED® LB M676 - Mini TOPLED Santana® LG M470 LS M47K, LO M47K, LY M47K Source: http://www.osram.convergy.de LUXEON: - LUMILED® LXK2-PW12-R00, LXK2-PW12-S00, LXK2-PW14-U00, LXK2-PW14-V00 LXK2-PM12-R00, LXK2-PM12-S00, LXK2-PM14-U00 LXK2-PE12-Q00, LXK2-PE12-R00, LXK2-PE12-S00, LXK2-PE14-T00, LXK2-PE14-U00 LXK2-PB12-K00, LXK2-PB12-L00, LXK2-PB12-M00, LXK2-PB14-N00, LXK2-PB14-P00, LXK2-PB14-Q00 LXK2-PR12-L00, LXK2-PR12-M00, LXK2-PR14-Q00, LXK2-PR14-R00 LXK2-PD12-Q00, LXK2-PD12-R00, LXK2-PD12-S00 LXK2-PH12-R00, LXK2-PH12-S00 LXK2-PL12-P00, LXK2-PL12-Q00, LXK2-PL12-R00 Source: www.luxeon.com KINGBRIGHT: KA-3528ASYC Source: www.kingbright.com
LSP1 LSP2 = solpad:SE13: SOLDER PAD E1542, drill 1,3mm, distributor Buerklin, 07F815
PASS1 PASS2 = Passermarks:ROUND_1MM
Q1 = dcdc_BB3_V0:TRANSISTOR-FET_SI7113DN
Q2 Q3 = EdM 2011:CRYSTAL2P: Quarz Crystal
R1 R2 R4-R15 R27 R28 = rcl:R-EU_: RESISTOR, European symbol
R3 R16-R26 R29-R59 = resistor:R-EU_: RESISTOR, European symbol
S1 = switch-tact:DTSM-6
SD1 = con-hirose:DM1AA-SF-PEJ
SW1 SW2 = switch-omron_1:5GSH935
T1 T3 = zetex:NMOSSOT23: MOS FET; OC_FARNELL: unknown; OC_NEWARK: unknown
T2 T5 T7 T9 T11 T13 = SESA:ZETEX_PMOSSOT23: MOS FET
T4 T6 T8 T10 T12 = SESA:ZETEX_NMOSSOT23: MOS FET
X1 = con-phoenix-381:MKDS1/2-3,81: MKDS 1/2-3,81 - Order No. 1727010 (RS-Online - 101-5384) Pitch: 3,81mm Number of terminals: 2 Rated Voltage: 160V Maximum load current/ cross section: 12A/1.5mm2-AWG16 Housing Interlocking: none Color: Green
X2 = con-hirose_1:DP11_8DP_2DS
X3 X7 = con-phoenix-381:MKDS1/3-3,81: MKDS 1/3-3,81 - Order No. 1727023 (RS-Online - 101-5390) Pitch: 3,81mm Number of terminals: 3 Rated Voltage: 160V Maximum load current/ cross section: 12A/1.5mm2-AWG16 Housing Interlocking: none Color: Green
X4 X5 = con-phoenix-381:MKDS1/8-3,81: MKDS 1/8-3,81 - Order No. 1727078 Pitch: 3,81mm Number of terminals: 8 Rated Voltage: 160V Maximum load current/ cross section: 12A/1.5mm2-AWG16 Housing Interlocking: none Color: Green
X6 = con-phoenix-381:MKDS1/4-3,81: MKDS 1/4-3,81 - Order No. 1727036 Pitch: 3,81mm Number of terminals: 4 Rated Voltage: 160V Maximum load current/ cross section: 12A/1.5mm2-AWG16 Housing Interlocking: none Color: Green

## Net classes
1 GND: width 0.2 mm
2 VCC: width 0.25 mm

## Board
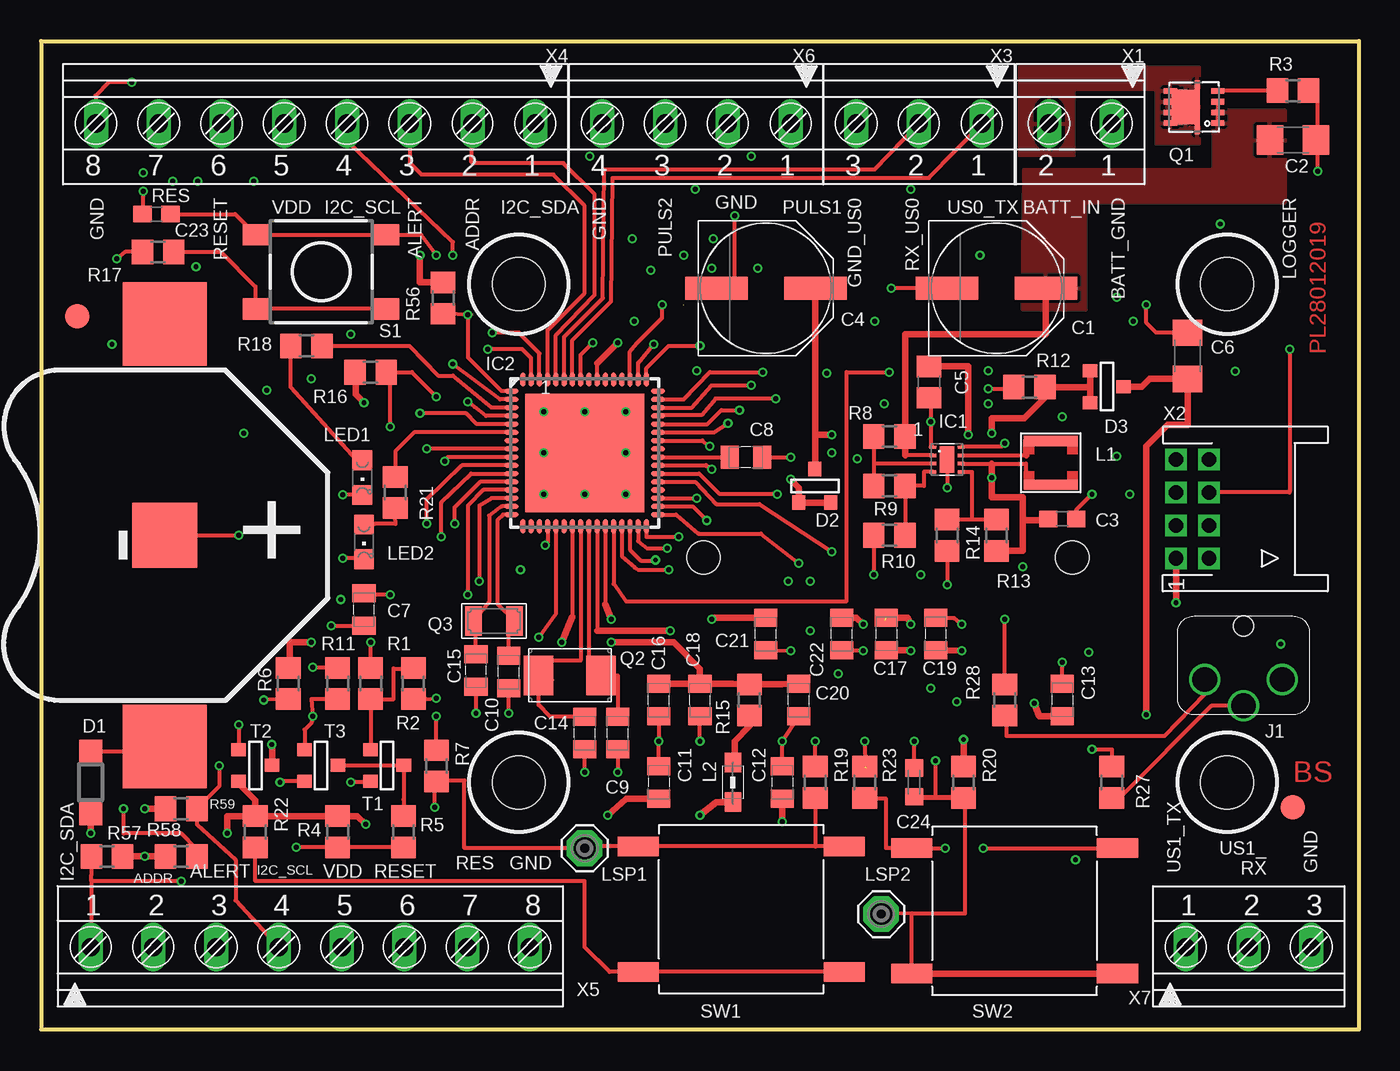
[diagram p6: board, top side]
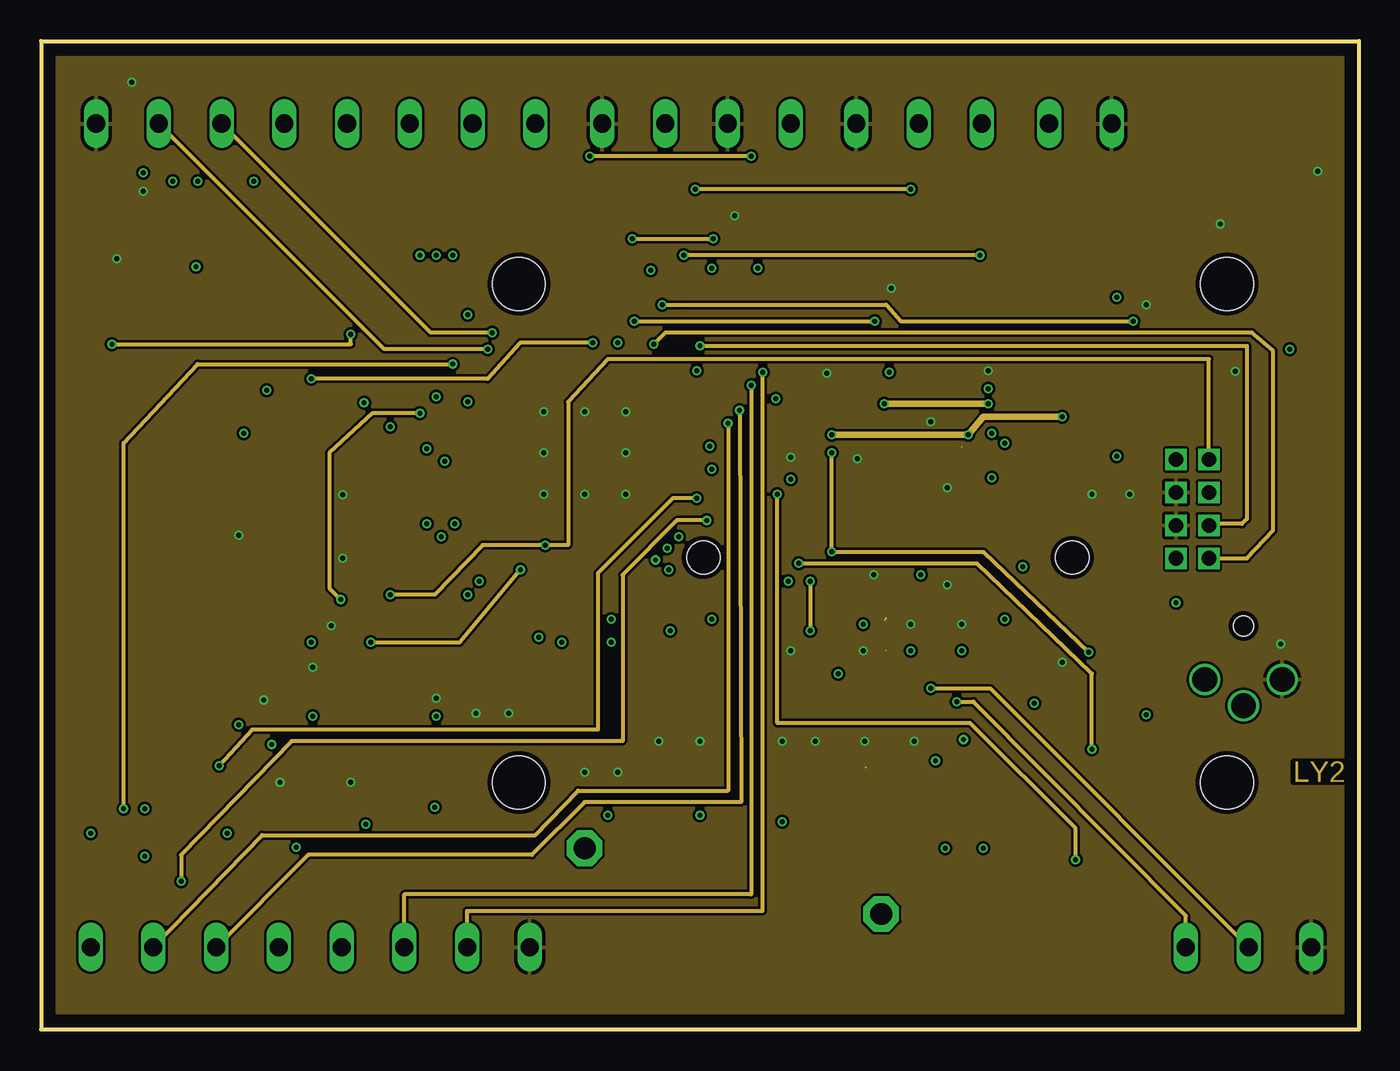
[diagram p7: board, inner layer Route2]
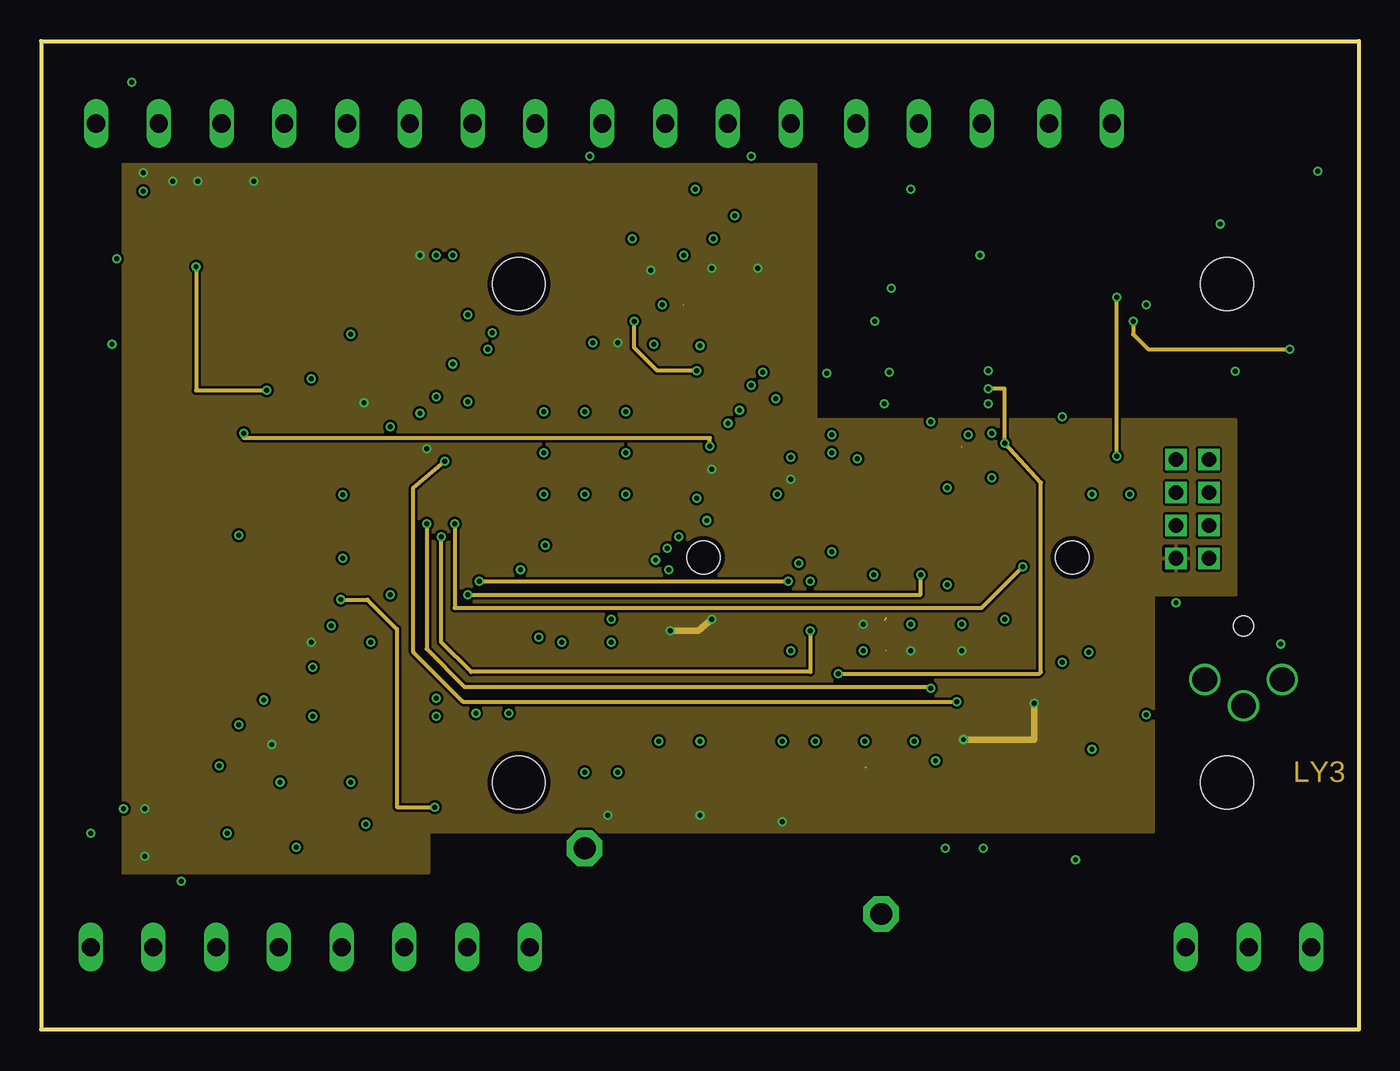
[diagram p8: board, inner layer Route3]
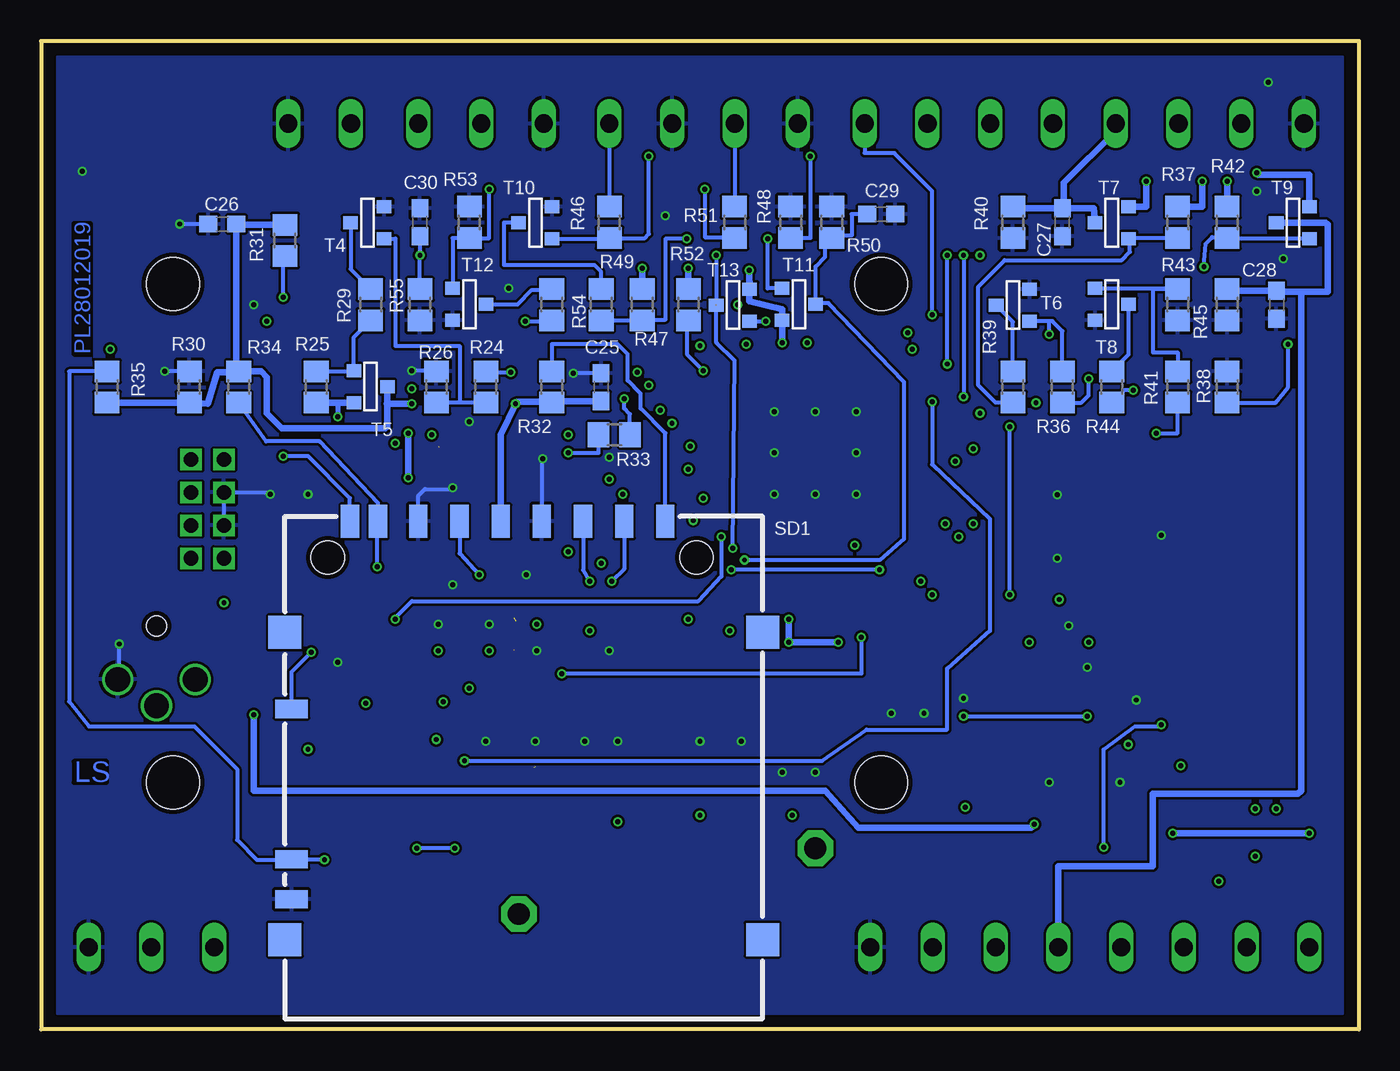
[diagram p9: board, bottom side, seen from below]

Size 80 x 60 mm. Coordinates in mm from the lower left corner, seen from the top.
Outline: 0,0 80,0 80,60 0,60 0,0
Copper layers (1+2*3+16): Top 0.035mm / dielectric 0.2mm / Route2 0.035mm / dielectric 1mm / Route3 0.035mm / dielectric 0.2mm / Bottom 0.035mm
Design rules "PCB-POOL HighSpec *": minimum track width 0.125mm, minimum drill 0.2mm, track to track 0.15mm, track to pad 0.15mm, pad to pad 0.15mm, via to via 0.15mm, smd to smd 0mil, copper to edge 0.3mm, drill to drill 0.2mm, minimum pad ring 0.2mm, minimum via ring 0.125mm, stop-mask expansion 0.075mm, vias tented up to drill 0mil, thermal gap 0.2mm
Holes 3.2 mm at 29,15 72,15 72,45.25 29,45.25

### Footprints (pad centres in the part's own frame; a part is rotated, then mirrored left to right if it is on the bottom)
3082 = smd 5.08 x 5.08: + -12.827,0; +1 12.827,0 | smd 3.962 x 3.962: - 0,0
PANASONIC_E = smd 3.8 x 1.4: + 3,0; - -3,0
C1206 = smd 1.6 x 1.8: 1 -1.4,0; 2 1.4,0
C0603 = smd 1.1 x 1: 1 -0.85,0; 2 0.85,0
C0805 = smd 1.3 x 1.5: 1 -0.95,0; 2 0.95,0
0805 = smd 1.092 x 1.397: 1 -0.991,0; 2 0.991,0
C0603K = smd 1.05 x 1.08: 1 -0.875,0; 2 0.875,0
SOD123 = smd 1.4 x 1.4: A 1.9,0; C -1.9,0
SOT-23$1 = smd 0.787 x 0.889: 1 0.025,-1.016; 2 -0.94,1.016; 3 0.991,1.016
DSG_PWSO-N8_EXP = smd 0.2 x 0.4: 1 -0.75,-0.85; 2 -0.25,-0.85; 3 0.25,-0.85; 4 0.75,-0.85; 5 0.75,0.85; 6 0.25,0.85; 7 -0.25,0.85; 8 -0.75,0.85 | smd 1.6 x 0.9: EXP 0,0
QFN64 = smd 0.85 x 0.3: 1 -4.45,3.75; 2 -4.45,3.25; 3 -4.45,2.75; 4 -4.45,2.25; 5 -4.45,1.75; 6 -4.45,1.25; 7 -4.45,0.75; 8 -4.45,0.25; 9 -4.45,-0.25; 10 -4.45,-0.75; 11 -4.45,-1.25; 12 -4.45,-1.75; 13 -4.45,-2.25; 14 -4.45,-2.75; 15 -4.45,-3.25; 16 -4.45,-3.75; 33 4.45,-3.75; 34 4.45,-3.25; 35 4.45,-2.75; 36 4.45,-2.25; 37 4.45,-1.75; 38 4.45,-1.25; 39 4.45,-0.75; 40 4.45,-0.25; 41 4.45,0.25; 42 4.45,0.75; 43 4.45,1.25; 44 4.45,1.75; 45 4.45,2.25; 46 4.45,2.75; 47 4.45,3.25; 48 4.45,3.75 | smd 0.3 x 0.85: 17 -3.75,-4.45; 18 -3.25,-4.45; 19 -2.75,-4.45; 20 -2.25,-4.45; 21 -1.75,-4.45; 22 -1.25,-4.45; 23 -0.75,-4.45; 24 -0.25,-4.45; 25 0.25,-4.45; 26 0.75,-4.45; 27 1.25,-4.45; 28 1.75,-4.45; 29 2.25,-4.45; 30 2.75,-4.45; 31 3.25,-4.45; 32 3.75,-4.45; 49 3.75,4.45; 50 3.25,4.45; 51 2.75,4.45; 52 2.25,4.45; 53 1.75,4.45; 54 1.25,4.45; 55 0.75,4.45; 56 0.25,4.45; 57 -0.25,4.45; 58 -0.75,4.45; 59 -1.25,4.45; 60 -1.75,4.45; 61 -2.25,4.45; 62 -2.75,4.45; 63 -3.25,4.45; 64 -3.75,4.45 | smd 7.2 x 7.2: 65 0,0
LUMBERG1502_01 = drill 1.5: P$1 -2.35,0.75; P$2 0,2.35; P$3 2.35,0.75 | hole 1.2: 0,-2.5
LPS3008 = smd 0.63 x 3.3: 1 -1.335,0; 2 1.335,0
0805' = smd 1.2 x 1: 1 -1.2,0; 2 1.2,0
CHIPLED_0805 = smd 1.2 x 1.2: A 0,-1.05; C 0,1.05
SE13 = drill 1.321 pad 2.159 octagon: MP 0,0
ROUND2_1.5MM = smd 1.5 x 1.5: FID 0,0
TRANSISTOR-FET_1212-8S = smd 0.8 x 0.34: 1 -1.435,0.97; 2 -1.435,0.325; 3 -1.435,-0.325; 4 -1.435,-0.975; 5 1.435,-0.975; 6 1.435,-0.325; 7 1.435,0.325; 8 1.435,0.975 | smd 0.3 x 0.8: 9 -0.2,-1.225; 10 -0.2,1.25 | smd 1.7 x 2.1: 11 0.5,-0.015
CRYSTAL2P5.0X3.2 = smd 1.8 x 2.4: 1 -1.9,0; 2 1.9,0
CRYSTAL2P3.2X1.5 = smd 1 x 1.8: 1 -1.25,0; 2 1.25,0
R0805 = smd 1.3 x 1.5: 1 -0.95,0; 2 0.95,0
DTSM-6 = smd 1.55 x 1.3: 1 -3.975,2.25; 2 3.975,2.25; 3 -3.975,-2.25; 4 3.975,-2.25
DM1AA-SF-PEJ = smd 1.1 x 2: 1 6.1,14.95; 2 3.6,14.95; 3 1.1,14.95; 4 -1.4,14.95; 5 -3.9,14.95; 6 -6.4,14.95; 7 -8.85,14.95; 8 -10.55,14.95; 9 8.6,14.95 | smd 2 x 1.1: CDS -14.1,3.55; COM -14.1,-8; WPS -14.1,-5.566 | smd 2 x 2: G1 -14.5,8.2; G2 -14.5,-10.45; G3 14.5,-10.45; G4 14.5,8.2 | hole 2: -11.9,12.75; 10.5,12.75
MULTIMEC_5GSH935 = smd 2.5 x 1.2: P -6.25,-3.81; P1 6.249,-3.81; S -6.25,3.81; S1 6.25,3.81
SOT-23 = smd 0.787 x 0.889: 1 0.025,-1.016; 2 -0.94,1.016; 3 0.991,1.016
ZETEX_SOT-23 = smd 0.787 x 0.889: 1 0.025,-1.016; 2 -0.94,1.016; 3 0.991,1.016
2POL381 = drill 1.1 long: 1 0,0; 2 3.81,0
DP11_8DP-2DS = drill 0.9 square: 1 3,-9.2; 2 3,-7.2; 3 1,-9.2; 4 1,-7.2; 5 -1,-9.2; 6 -1,-7.2; 7 -3,-9.2; 8 -3,-7.2
3POL381 = drill 1.1 long: 1 0,0; 2 3.81,0; 3 7.62,0
8POL381 = drill 1.1 long: 1 0,0; 2 3.81,0; 3 7.62,0; 4 11.43,0; 5 15.24,0; 6 19.05,0; 7 22.86,0; 8 26.67,0
4POL381 = drill 1.1 long: 1 0,0; 2 3.81,0; 3 7.62,0; 4 11.43,0

### Placement (x,y rotation side)
BH1  7.5,30 90 top
C1  58,45 0 top
C2  76,54 0 top
C3  62,31 0 top
C4  44,45 0 top
C5  53.9,39.3 270 top
C6  69.6,40.9 270 top
C7  19.6,25.5 90 top
C8  42.8,34.75 180 top
C9  35,18 90 top
C10  28.4,21.7 90 top
C11  37.5,15 270 top
C12  45,15 270 top
C13  62,20 270 top
C14  33,18 90 top
C15  26.4,21.8 90 top
C16  37.5,20 90 top
C17  51.3,24 270 top
C18  40,20 90 top
C19  54.3,24 270 top
C20  46,20 90 top
C21  44,24 90 top
C22  48.6,24 90 top
C23  7,49.5 0 top
C24  53,15 270 top
C25  46,39 90 bottom
C26  69,48.9 180 bottom
C27  18,49 270 bottom
C28  5,44 270 bottom
C29  29,49.5 0 bottom
C30  57,49 90 bottom
D1  3,15 90 top
D2  47,33 180 top
D3  64.7,39 90 top
IC1  55,34.6 270 top
IC2  33,35 0 top
J1  73,22 180 top
L1  61.3,34.4 270 top
L2  BLM21B102S  [0805']  42,15 90 top
LED1  19.5,33.5 180 top
LED2  19.6,29.6 180 top
LSP1  33,11 0 top
LSP2  51,7 0 top
PASS1  2.2,43.3 0 top
PASS2  76,13.5 0 top
Q1  70,56 180 top
Q2  32.1,21.5 180 top
Q3  27.5,24.8 180 top
R1  20,21 270 top
R2  22.6,21 90 top
R3  76,57 180 top
R4  18,12 90 top
R5  22,12 270 top
R6  15,21 90 top
R7  24,16 90 top
R8  51.5,36 0 top
R9  51.5,33 180 top
R10  51.5,30 0 top
R11  18,21 270 top
R12  60,39 180 top
R13  58,30 270 top
R14  55,30 90 top
R15  43,20 90 top
R16  20,39.9 180 top
R17  7.1,47.2 180 top
R18  16.1,41.5 180 top
R19  47,15 270 top
R20  56,15 90 top
R21  21.5,32.6 270 top
R22  13,12 90 top
R23  50,15 90 top
R24  53,39 90 bottom
R25  63.3,39 270 bottom
R26  56,39 270 bottom
R27  65,15 270 top
R28  58.5,20 270 top
R29  60,44 270 bottom
R30  71,39 270 bottom
R31  65.2,47.9 90 bottom
R32  49,39 270 bottom
R33  45.2,36.1 0 bottom
R34  68,39 90 bottom
R35  76,39 270 bottom
R36  18,39 270 bottom
R37  11,49 90 bottom
R38  8,39 270 bottom
R39  21,39 270 bottom
R40  21,49 90 bottom
R41  11,39 270 bottom
R42  8,49 90 bottom
R43  11,44 90 bottom
R44  15,39 270 bottom
R45  8,44 90 bottom
R46  45.5,49 90 bottom
R47  43.5,44 90 bottom
R48  34.5,49 270 bottom
R49  46,44 270 bottom
R50  32,49 270 bottom
R51  37.9,49 90 bottom
R52  40.7,44 90 bottom
R53  54,49 270 bottom
R54  49,44 270 bottom
R55  57,44 90 bottom
R56  24.4,44.4 270 top
R57  4,10.5 0 top
R58  8.5,10.5 180 top
R59  8.5,13.4 180 top
S1  17,46 0 top
SD1  50.7,15.9 0 bottom
SW1  42.5,7.3 180 top
SW2  59.1,7.2 0 top
T1  21,16 90 top
T2  13,16 90 top
T3  17,16 90 top
T4  60.2,49 270 bottom
T5  60,39 90 bottom
T6  21,44 270 bottom
T7  15,49 270 bottom
T8  15,44 90 bottom
T9  4,49 270 bottom
T10  50,49 270 bottom
T11  34,44 90 bottom
T12  54,44 90 bottom
T13  38,44 270 bottom
X1  65,55 180 top
X2  78.1,31.6 270 top
X3  57.1,55 180 top
X4  30,55 180 top
X5  3,5 0 top
X6  45.5,55 180 top
X7  69.5,5 0 top

### Tracks (layer width: path | path; a pad name or v marks a point on that pad's centre or on a via)
1  (via drill 0.3)
  Top 0.254: IC1.6 57.7,34.35 59.8,34.35 59.8,33.06 L1.2 | 61.15,30.9 C3.1 | R12.1 61,39 61,38.9 | 61,38.4 61,38.9 | 61,38.9 61.1,39 | 63.58,39 63.68,39.1
  Top 0.406: 57.7,34.35 v57.7,33.5 57.7,32.3 59.6,32.3 59.6,30.9 | 59.6,30.9 61.15,30.9 | R13.2 59.6,29.05 59.6,30.9 | 61,38.4 59.7,37.1 57.7,37.1 v57.7,36.2 | D3.2 63.68,39.1 D3.3 | 61.1,39 63.58,39
  Bottom 0.406: v57.7,33.5 v57.7,36.2
_
  pour Top: 70.3,53.8 70.3,58.4 59.4,58.4 59.4,53.1 62.7,53.1 62.7,57.1 67.7,57.1 67.7,53.8
AVDD  (via drill 0.3)
  Top 0.254: IC2.23 32.25,25.05 | IC2.27 34.25,25.8
  Top 0.406: C16.2 C18.2 | C18.2 41.96,20.99 R15.2 44.96,20.95 C20.2 | 32.25,25.05 v31.6,23.5 | v34.6,23.5 38.4,23.5 40,21.9 C18.2 | 34.25,25.8 v34.6,24.9
  Bottom 0.406: v34.6,24.9 v34.6,23.5 v31.6,23.5
BATT_INPUT
  Top 0.254: Q1.3 Q1.1 | IC1.2 52.45,34.85
  Top 0.406: 52.45,34.85 R8.2 52.45,42.2 61,42.2 C1.+
  pour Top: 59.6,43.7 59.7,52.2 71.2,52.2 71.2,55.8 75.5,55.8 75.5,50.2 63.4,50.2 63.4,43.7
GND  (via drill 0.3)  (2 unrouted)
  Top 0.254: 77.5,56.75 R3.1 77.5,56.45 77.5,54.2 | IC1.1 54,35.35 v54,36.9 54,38 54.1,38.15 C5.2 | C1.- v51.6,45 | R10.1 v50.55,27.6 | R14.1 v55,27 | C13.1 62.2,20.89 62,20.9 v62,22.3 | 77.5,54.2 77.5,53.9 | 77.5,53.9 77.4,53.8 | v77.5,52.1 77.5,53.9 | 77.5,54.2 C2.2 | C15.1 v26.4,19.2 | C16.1 37.49,18.6 v37.49,17.51 v37.5,17.5 C11.1 | v40,17.5 C18.1 | C20.1 v45,17.5 C12.1 | C21.1 v45.5,23 | BH1.- v12,30 | LED2.C 19.6,28.6 v18.3,28.6 | LED1.C v18.3,32.45 | R6.1 v13.5,20 | 17.95,21.9 R11.1 17.95,22 v16.5,22 | T1.2 20,15 v18.8,15 18.7,15 | T3.2 14.5,15.06 v14.5,15 | 22.2,20.05 R2.1 23.35,20.05 v24,20.1 | v28.4,19.2 C10.1 | C24.1 v53,17.5 | 50.1,15.88 v50,17.5 | R19.1 v47,17.5 | C8.1 v45.5,34.75 | C23.1 6.2,49.5 v6.2,50.9 | R17.2 5.1,47.2 v4.6,46.8 | 19.01,24.51 C7.1 v17.6,24.5 | IC1.EXP v55,32.9 | C4.- 42.1,45 v42.1,49.4 | IC2.65 v33,32.5 | C22.1 49.69,23.01 v49.9,23 | 51,25 51.2,24.8 | C19.1 55.41,24.99 v55.9,24.6 | C3.2 62.85,31.55 v63.8,32.5 | C9.1 v35,15.6 | 3.33,55.23 X4.8 3.3,55.03 3.3,56.7 4.1,57.5 v5.5,57.5 | 68.8,42.3 67.7,42.3 67.1,42.9 v67.1,44 | v33,15.6 C14.1
  Top 0.406: C17.1 52.61,24.99 v52.8,24.6 | C6.1 68.8,42.3
  Bottom 0.254: 55.02,43.1 T12.2 | C26.2 v71.6,48.9 | J1.P$1 75.25,21.45 v75.25,23.4 | R26.1 56,40.3 56.1,40 v57.5,40 | C25.2 v47.7,39.85 | v66.1,32.5 66.2,32.6 X2.5 X2.3 | R30.1 v72.5,39.95 | SD1.6 57.1,32.4 56.7,32.8 55.1,32.8 v55,32.9 | 49.6,34.7 SD1.3
  other vias: 30.5,37.5 33,37.5 35.5,37.5 35.5,35 30.5,35 30.5,32.5 35.5,32.5 49.55,34.65
  pour Route2: 1,59 79,59 79,1 1,1
  pour Bottom: 1,59 79,59 79,1 1,1
MCU_RESET  (via drill 0.3)
  Top 0.254: IC2.20 30.75,29.55 v30.6,29.4 | C23.2 11.78,49.5 S1.1 S1.2 23.05,48.25 v24,47 | v21.2,36.6 21.2,39.95 R16.1 22.5,39.9 v24,38.4 | v21.2,26.4 19.79,26.4 C7.2
  Route2 0.254: X2.8 70.9,40.7 34.4,40.7 32,38.1 32,29.4 v30.6,29.4 26.8,29.4 23.9,26.4 v21.2,26.4
  Bottom 0.254: v24,47 v24,38.4 | v21.2,26.4 v21.2,36.6
N$2
  Top 0.254: R1.2 21.4,20.05 21.4,21.9 22.7,21.9 R2.2 | R1.2 20,20.2 | R1.2 20,17.01 T1.3
N$3
  Bottom 0.254: R37.1 13.94,48.05 T7.3 13.9,47.92 13.9,47.2 14.4,46.7 21.5,46.7 23.1,45.1 23.1,39.1 22.05,38.05 R39.2
N$4
  Bottom 0.254: R25.1 61.06,39.95 T5.3 61.02,42.03 R29.2
N$5
  Top 0.254: IC1.3 50.55,34.35 | 50.55,34.35 R9.2 | R8.1 50.55,34.35
N$6
  Bottom 0.254: T4.1 61.22,46.17 R29.1
N$7
  Bottom 0.254: R24.1 54.6,38.05 | 54.6,38.05 R26.2 | T4.3 58.5,48.01 58.5,41.5 54.6,41.5 54.6,38.05
N$8
  Top 0.254: IC1.4 53.6,33.85 53.6,33 R9.1 R10.2
N$9
  Top 0.254: IC1.7 59.8,34.85 | L1.1 59.8,35.73
  Top 0.406: 59.8,35.73 59.8,34.85
N$10
  Bottom 0.254: R39.1 21,42.96 T6.1
N$11  (via drill 0.3)
  Route2 0.254: v4.3,41.6 18.8,41.6 v18.8,42.2
  Bottom 0.254: R36.1 18,42.4 18.6,43 18.8,43 | 18.8,43 T6.3 | R38.2 5.05,38.05 4.3,39 v4.3,41.6 | v18.8,42.2 18.8,43
N$12  (via drill 0.3)
  Route3 0.254: v9.4,46.3 9.4,38.8 v13.7,38.8
  Bottom 0.254: T9.3 8,48.01 R42.1 | R42.1 8,48 | v13.7,38.8 14.25,38.8 R44.2 | v9.4,46.3 9.3,47.7 8.9,48.1 8.05,48.1 R42.1
N$13
  Bottom 0.254: T8.1 13.98,40.97 R44.1
N$14
  Top 0.406: R15.1 43,18.4 42.1,17.5 42.1,16.3 L2.2
N$15
  Top 0.254: LED1.A 19.15,34.55 15.15,39 R18.2
N$16
  Top 0.254: R21.2 21.45,31.45 21.5,30.7 20.25,30.7 LED2.A
N$17
  Top 0.254: 7.5,17.2 BH1.+ 7.5,16.9 D1.A
N$18
  Bottom 0.254: T8.3 11,44.99 R43.2 12.5,44.95 12.5,41.1 11,41.1 R41.1
N$19
  Bottom 0.254: SD1.9 42.1,36.2 43.6,37.7 43.6,38.6 44.4,39.4 44.4,41 45,41.6 49,41.6 R32.1
N$20
  Top 0.254: R3.2 71.46,57 Q1.4
N$21  (via drill 0.3)
  Top 0.254: R5.2 R4.1 v15.5,11.05 | v12,18.5 12,17.01 T2.3
  Bottom 0.254: v15.5,11.05 15.5,17 13.6,18.4 12.1,18.4 v12,18.5
N$22  (via drill 0.3)
  Top 0.254: R7.2 v24,19 | 15.9,16.99 T3.3 16,17.01 16,18.2 16.4,18.6 v16.5,19 16.4,20.05 R11.2
  Bottom 0.254: v24,19 v16.5,19
N$23  (via drill 0.3)
  Route3 0.254: v65.3,34.8 v65.3,44.45
  Bottom 0.254: v65.3,44.45 65.3,46.85 R31.1 | SD1.8 61.25,32.25 63.8,34.8 v65.3,34.8
N$24  (via drill 0.3)
  Route2 0.254: v35.9,48 v40.8,48
  Bottom 0.254: T11.3 35.89,44.99 v35.9,48 | v40.8,48 42.1,48 42.1,43.1 43.45,43.1 R47.1 R49.2
N$25
  Top 0.254: T3.1 T1.1 22,13.97 R5.1
N$26
  Top 0.254: 21.02,43.7 S1.4 S1.3 13,43.77 13,45.1 10.9,47.2 R17.1
N$27  (via drill 0.3)
  Top 0.254: v54.9,11 v54.89,11.01 SW2.S 51.3,11.01 51.3,14 50,14 R23.1 50,13.86 | v57.2,11 SW2.S1
  Bottom 0.254: v54.9,11 v57.2,11
N$28
  Bottom 0.254: R49.1 46,46 46.4,46.4 51.9,46.4 51.9,49 51.02,49 T10.1
N$29
  Top 0.254: SW1.S SW1.S1 34.51,3.49 33,5 33,9 13,9 R22.1
N$30
  Top 0.254: IC2.40 C8.2
N$31  (via drill 0.3)
  Route2 0.254: v43.1,53 v33.3,53
  Bottom 0.254: T10.3 45.54,48.01 R46.1 43.35,48.05 43.1,48.3 v43.1,53 | v33.3,53 33.3,48.05 R48.2
N$32  (via drill 0.3)
  Route2 0.254: v36,43 v50.6,43
  Route3 0.254: v39.8,40 37.4,40 36,41.4 v36,43
  Bottom 0.254: T13.3 v36,43.01 v36,43 | v50.6,43 49,43 R54.2 | R52.1 40.5,43.05 40.5,43 40.8,43 40.8,41 v39.8,40
N$33
  Bottom 0.254: T12.1 51.08,44.02 50.2,44.9 49.05,44.9 R54.1
N$34  (via drill 0.3)
  Route2 0.254: v52.8,51 v39.7,51
  Bottom 0.254: T12.3 55.02,48.05 R53.2 52.8,48.05 v52.8,51 | 38.05,48.1 R51.1 37.9,48.1 39.7,48.1 v39.7,51
N$46
  Top 0.254: IC1.5 56.5,33.85 56.5,30.95 | R13.1 56.5,30.95 | 56.5,30.95 R14.2
PA0_SENSOR_I2C_SDA  (via drill 0.3)
  Top 0.254: R56.2 26.1,43.4 v25.9,43.4 25.9,40.8 27.95,38.75 IC2.1
  Bottom 0.254: X4.1 30,53.2 28.2,53.2 25.9,50.9 v25.9,43.4
PA1_SENSOR_I2C_SCL  (via drill 0.3)
  Top 0.254: IC2.2 27.85,38.25 v25,40.4 | v25,47 25,47.8 18.6,53.9 18.6,54.97 X4.4 | R58.1 9.45,10.95 8.5,11.9 5,11.9 v5,13.4
  Route2 0.254: v5,13.4 5,35.6 9.5,40.4 v25,40.4
  Bottom 0.254: v25,40.4 v25,47
PA2_POWER_LED
  Top 0.254: IC2.3 27.35,37.75 25,39.7 24.1,39.7 22.35,41.5 R18.1
PA3_KEY_START_STOP  (via drill 0.3)
  Top 0.254: SW2.P 52.85,7.05 | 52.85,7.05 LSP2.MP | R20.1 53.08,14.05 C24.2 54.3,14.12 | 54.3,14.12 55.88,14.12 56.1,13.9 56.1,7.05 52.85,7.05 | 54.3,14.12 v54.3,16.3 | IC2.4 27,37.25 26.3,37.8 v25.9,38.1
  Top 0.406: SW2.P1 SW2.P
  Bottom 0.254: v54.3,16.3 32.6,16.3 29.9,18.2 25,18.2 25,21.9 22.4,24.2 22.4,31 25.9,34.3 v25.9,38.1
PA4_SIGNAL_POWER  (via drill 0.3)
  Top 0.254: SW1.P 47,11.11 | 47,11.11 SW1.P1 32.8,11.11 LSP1.MP 25.7,11 25.7,15.1 24.05,15.1 R7.1 23.9,14.95 v23.9,13.5 | IC2.5 26.45,36.75 25.8,37.4 v23,37.4 | R19.2 47,11.11
  Route2 0.254: v23,37.4 20.1,37.4 17.5,35 17.5,26.8 v18.2,26.1
  Route3 0.254: v18.2,26.1 19.8,26.1 21.6,24.3 21.6,13.5 v23.9,13.5
PA5_LOG_FLUSH_LED
  Top 0.254: IC2.6 22.65,36.25 21.5,35.1 R21.1
PB7_LFXTAL_P
  Top 0.254: IC2.15 27.95,31.75 27.2,31.2 27.2,25.95 Q3.2 26.4,24.65 C15.2
PB8_LFXTAL_N
  Top 0.254: IC2.16 28.05,31.25 27.7,30.9 27.7,25.85 Q3.1 28.4,24.45 C10.2
PB11_POWER_GOOD  (via drill 0.3)  (1 unrouted)
  Top 0.254: 31.25,30.7 IC2.21 31.25,25.25 v30.2,23.8 | 59.05,38.9 R12.2 58.95,38.9 v57.5,38.9 | 55.9,35.4 58.3,35.4 v58.5,35.6
  Route3 0.254: v48.4,21.6 60.6,21.6 60.7,21.7 60.7,33.2 v58.5,35.6 58.5,38.9 v57.5,38.9
  Bottom 0.254: v30.2,23.8 30.2,21.6 v48.4,21.6
PB13_HFXTAL_P
  Top 0.254: IC2.24 32.75,22.4 30.7,22.4 30.3,22.2 Q2.2 | 31,21.2 Q2.2 | C14.2 30.91,18.99 30.2,19.7 Q2.2
PB14_HFXTAL_N
  Top 0.254: IC2.25 33.25,21.55 Q2.1 34.3,21.49 35,21.49 C9.2
PC0_US1_TX  (via drill 0.3)
  Top 0.254: IC2.9 24.7,34.75 v24.5,34.5
  Route2 0.254: X7.1 69.5,6.9 56.6,19.9 v55.6,19.9
  Route3 0.254: v24.5,34.5 22.6,32.9 22.6,22.9 25.6,19.9 v55.6,19.9
PC1_US1_RX  (via drill 0.3)
  Top 0.254: IC2.10 25.55,34.25 23.4,32.2 v23.4,30.7
  Route2 0.254: v54,20.7 57.61,20.7 X7.2
  Route3 0.254: v23.4,30.7 23.4,23.1 25.7,20.8 54,20.8 v54,20.7
PC2_SD_SDO  (via drill 0.3)
  Top 0.254: IC2.11 26.1,33.75 24.3,32 v24.3,29.9
  Route2 0.254: v46.7,27.2 v46.7,24.2
  Route3 0.254: v46.7,24.2 46.7,21.7 26.1,21.7 24.3,23.5 v24.3,29.9
  Bottom 0.254: SD1.2 47.1,27.9 v46.7,27.2
PC3_SD_SDI  (via drill 0.3)
  Top 0.254: IC2.12 26.65,33.25 25.1,31.7 v25.1,30.7
  Route3 0.254: v25.1,30.7 25.1,25.6 57.1,25.6 v59.6,28.1
  Bottom 0.254: v59.6,28.1 59.6,30.8 SD1.7 59.55,31.95 63.1,35.7 66.35,35.7 R34.1
PC4_SD_CLK  (via drill 0.3)
  Top 0.254: IC2.13 26.85,32.75 25.9,31.8 v25.9,26.4
  Route3 0.254: v25.9,26.4 53.4,26.4 v53.4,27.6
  Bottom 0.254: SD1.5 54.6,28.9 v53.4,27.6
PC5_SD_CS  (via drill 0.3)
  Top 0.254: v26.6,27.2 26.6,31.8 27.35,32.25 IC2.14
  Route3 0.254: v26.6,27.2 v45.35,27.2
  Bottom 0.254: SD1.1 44.6,27.95 v45.35,27.2
PC6_SD_CD  (via drill 0.3)
  Top 0.254: IC2.37 39.7,33.25 41,31.9 43.6,31.9 v48,29
  Route2 0.254: v63.6,22.9 57.2,29 v48,29 v48,35
  Bottom 0.254: 46.2,36.05 R33.1 46.15,35 v48,35 | SD1.CDS 64.8,21.7 v63.6,22.9
PC7_SD_WP  (via drill 0.3)
  Top 0.254: IC2.38 39.95,33.75 41.2,32.5 v44.7,32.5
  Route2 0.254: v44.7,32.5 44.7,18.6 56.4,18.6 62.8,12.2 v62.8,10.3
  Bottom 0.254: v62.8,10.3 64.8,10.3 SD1.WPS 64.83,10.3 66.9,10.3 68.1,11.5 68.1,15.8 70.7,18.4 77.1,18.4 78.3,19.9 78.3,39.95 R35.1
PC9_SENSOR2_MOSFET  (via drill 0.3)
  Top 0.254: IC2.42 40.15,35.75 v40.6,35.4
  Route3 0.254: v40.6,35.4 40.6,35.9 12.3,35.9 v12.3,36.2
  Bottom 0.254: v12.3,36.2 11,36.2 R41.2
PC10_SENSOR2_ADDR  (via drill 0.3)
  Top 0.254: IC2.43 40.85,36.25 v41.7,36.8
  Route2 0.254: v41.7,36.8 41.7,14.5 32.6,14.5 30,11.8 13.41,11.8 X5.2
PC11_SENSOR2_ALERT  (via drill 0.3)
  Top 0.254: IC2.44 40.45,36.75 41.3,37.6 v42.4,37.6
  Route2 0.254: v42.4,37.6 42.5,13.8 33,13.8 29.8,10.6 16.22,10.6 X5.3
PC12_SD_PULLUP  (via drill 0.3)
  Top 0.254: v44.6,38.3 40.95,38.3 40.1,37.3 37.5,37.3 IC2.45
  Bottom 0.254: R33.2 44.25,37.35 44.6,37.7 v44.6,38.3
PC13_SENSOR2_RESET  (via drill 0.3)
  Top 0.254: IC2.46 39.5,37.75 40.7,39.1 v43.1,39.1
  Route2 0.254: v43.1,39.1 43.1,8.2 22.05,8.2 X5.6
PC14_SENSOR2_RESERVE  (via drill 0.3)
  Top 0.254: IC2.47 39,38.25 40.6,39.9 v43.8,39.9
  Route2 0.254: X5.7 25.86,7.2 43.8,7.2 v43.8,39.9
PD0_SD_POWER  (via drill 0.3)
  Top 0.254: IC2.28 34.75,27.05 35.5,26 48.9,26 48.9,39.9 v51.5,39.9
  Bottom 0.254: 52.45,39.9 v51.5,39.9
  Bottom 0.406: R24.2 52.45,39.9
PD1_HOLD_POWER  (via drill 0.3)
  Top 0.254: IC2.29 35.25,28.73 36.03,28.05 36.25,27.9 v38.1,27.9 | R1.1 v20,23.5
  Route2 0.254: v20,23.5 25.4,23.5 v29.1,27.9
  Bottom 0.254: v29.1,27.9 v38.1,27.9
PD2_PULS1_COUNTER  (via drill 0.3)
  Top 0.254: IC2.30 35.75,29.13 36.41,28.47 37.27,28.47 v37.3,28.5
  Bottom 0.254: T11.1 32.91,44.1 32.2,44.1 27.6,39.3 27.6,29.8 29.1,28.5 v37.3,28.5 | 33,44.04 T11.1 | T11.1 32.98,46.32 32.4,46.9 32.4,48.15 | C29.1 30.8,49.5 30.8,48.2 32,48.2 R50.2
  Bottom 0.406: 32.4,48.15 32,48.15 R50.2
PD3_PULS2_COUNTER  (via drill 0.3)  (1 unrouted)
  Top 0.254: IC2.31 36.25,29.65 36.8,29.2 v38,29.2
  Route2 0.254: v57,47 v39,47
  Bottom 0.254: v38,29.2 37.9,40.6 39,41.7 39,43.96 T13.1 | C30.1 v57,47 R55.2 | v39,47 39,43.99
PD4_LEUART_TX  (via drill 0.3)
  Top 0.254: IC2.32 36.75,29.9 v38.7,29.9 | R28.1 v58.5,24.9
  Bottom 0.254: v38.7,29.9 38.7,27.5 40.1,26 57.5,26 58.6,24.9 v58.5,24.9
PD5_LEUART_RX  (via drill 0.3)
  Top 0.254: IC2.33 38.55,31.25 39.9,30.1 43.7,30.1 v46,28.3 | 64.65,15.6 R27.1 65,17 v63.8,17
  Route2 0.254: v63.8,17 63.8,21.6 56.8,28.3 v46,28.3
PD6_SENSOR_I2C_SDA  (via drill 0.3)
  Top 0.254: R57.1 3.05,9.4 3.05,9 | 3.05,9 3.05,5.05 X5.1 | IC2.34 39.55,31.75 v40.4,30.9 | v8.5,9 3.05,9
  Route2 0.254: v8.5,9 8.5,10.6 15.2,17.5 35.3,17.5 35.3,27.6 38.6,30.9 v40.4,30.9
PD7_SENSOR_I2C_SCL  (via drill 0.3)
  Top 0.254: X5.4 11.8,7.83 11.8,10.3 9.45,12.45 R59.1 10.8,14.75 v10.8,16 | IC2.35 v39.8,32.25
  Route2 0.254: v10.8,16 12.8,18.2 33.8,18.2 33.8,27.7 38.35,32.25 v39.8,32.25
PE9_SENSOR1_MOSFET  (via drill 0.3)
  Top 0.254: IC2.57 32.75,40.95 v33.5,41.7
  Route2 0.254: v33.5,41.7 29.1,41.7 27.1,39.5 v16.4,39.5
  Bottom 0.254: R36.2 16.85,38.05 16.4,38.5 v16.4,39.5
PE10_US0_TX
  Top 0.254: X3.1 53.9,51.7 34.7,51.7 34.6,44.2 32.25,41.85 IC2.58
PE11_US0_RX
  Top 0.254: X3.2 50.59,52.2 34.22,52.2 34.2,52.22 34.1,44.4 31.75,42.05 IC2.59
PE12_SENSOR1_ADDR
  Top 0.254: X4.2 26.09,52.71 26.2,52.6 31.7,52.6 33.6,50.7 33.6,44.6 31.25,42.15 IC2.60
PE13_SENSOR1_ALERT
  Top 0.254: IC2.61 30.75,42.45 33,44.7 33,50 31.1,51.9 23.1,51.9 22.4,52.6 22.4,54.98 X4.3
PE14_SENSOR1_RESET  (via drill 0.3)
  Top 0.254: IC2.62 30.25,41.05 29,42.3 v27.4,42.3
  Route2 0.254: v27.4,42.3 23.65,42.3 X4.6
PE15_SENSOR1_RESERVE  (via drill 0.3)
  Top 0.254: IC2.63 29.75,40.75 29.2,41.3 v27.1,41.3
  Route2 0.254: v27.1,41.3 20.84,41.3 X4.7
PF0_DBG_SWCLK  (via drill 0.3)
  Top 0.254: IC2.49 36.75,40.15 38.1,41.5 v40,41.5
  Route2 0.254: v40,41.5 73.2,41.5 73.2,31 72.9,30.7 71,30.7 X2.4
PF1_DBG_SWDIO  (via drill 0.3)
  Top 0.254: 36.25,39.85 IC2.50 36.25,40.45 v37.2,41.6
  Route2 0.254: X2.2 73.2,28.6 74.8,30.3 74.8,41.2 73.5,42.3 37.9,42.3 v37.2,41.6
PF2_DBG_SWO  (via drill 0.3)
  Top 0.254: IC2.51 35.75,41.15 36.15,41.65 37.7,43.2 v37.7,44 | v75.8,41.3 75.8,32.6 X2.6
  Route2 0.254: v37.7,44 51.3,44 52.2,43 v66.3,43
  Route3 0.254: v66.3,43 66.3,42.2 67.2,41.3 v75.8,41.3
PULS1_COUNTER
  Bottom 0.254: 45.5,55.1 X6.1 R46.2
PULS2_COUNTER
  Bottom 0.254: X6.3 37.88,54.3 R51.2
RXD_HOST
  Top 0.254: J1.P$3 70.65,20.35 68.2,17.8 58.6,17.8 58.6,19.05 R28.2
SD_3V  (via drill 0.3)
  Route2 0.406: v57.5,38 v51.2,38
  Bottom 0.254: 68.05,39.9 R34.2 68.15,40.1 | 48.9,38.15 R32.2 49.05,38.1 | 59.1,36.5 59,36.6 | 59,39.2 59,39.01 T5.1 59.01,38 | 51.1,38.1 v51.2,38 | 68.1,48.85 C26.1
  Bottom 0.406: R35.2 R30.2 69.9,38 69.3,39.9 68.05,39.9 | C25.1 48.9,38.15 | R34.2 66.65,39.95 66.3,39.6 66.3,37.4 65.4,36.5 59.1,36.5 | 59,36.6 59,39.01 | v57.5,38 59.01,38 | 49.05,38.1 51.1,38.1 | SD1.4 52.1,36.1 v51.2,38 | R31.2 68.1,48.85 | 68.15,40.1 C26.1
TXD_HOST
  Top 0.254: J1.P$2 71.05,19.65 65.5,14.1 65.05,14.1 R27.2
VBATT  (via drill 0.3)
  Top 0.254: 12.95,12.95 R22.2 | 69.8,39.2 C6.2 | T2.2 11.98,14.92
  Top 0.406: D1.C v3,11.9 | v11.3,11.9 11.3,12.95 12.95,12.95 | v19.7,12.45 19.2,12.95 R4.2 R22.2 13,13.9 11.98,14.92 | D3.1 66.83,39.02 67.3,39.5 C6.2 69.6,36.7 68.4,36.7 67.1,35.4 v67.1,19.1
  Bottom 0.406: v3,11.9 v11.3,11.9 | v67.1,19.1 67.1,14.5 32.4,14.5 30.4,12.25 19.9,12.25 v19.7,12.45
VDD_SENSOR1
  Bottom 0.254: 17.9,49.95 C27.1 18.1,49.85
  Bottom 0.406: X4.5 14.76,54.54 17.9,51.4 17.9,49.95 | C27.1 16.09,49.85 T7.1 | 18.1,49.85 20.9,49.85 R40.2
VDD_SENSOR2
  Bottom 0.254: 2,48.98 2,48.9 1.9,48.9 | 5,44.8 C28.1 | 8,44.85 R45.2
  Bottom 0.406: X5.5 18.25,9.9 12.5,9.9 12.5,14.3 3.7,14.3 3.5,14.5 3.5,44.75 C28.1 8,44.85 | T9.1 2,48.98 | 1.9,48.9 1.9,44.8 5,44.8
VMCU  (via drill 0.3)  (1 unrouted)
  Top 0.254: C21.2 | C12.2 44.79,13.8 45.2,14 | R20.2 56,16.05 | R6.2 15.1,21.95 | v16.4,23.5 16.4,23.3 | 14.02,17.32 v14,17.3 | IC2.55 33.75,40.45 | C19.2 53.99,23.01 | R16.2 19.1,39.9 | 33.7,30.55 IC2.26 33.75,24.2 | IC2.8 v23.4,35.25 | v52.79,23.01 v52.8,23 | 40.7,25 v40.7,24.9 | IC2.39 40.35,34.25
  Top 0.305: 40.35,34.25 v40.7,34
  Top 0.406: X2.1 v68.9,25.9 | 56,16.05 v56,17.6 | L2.1 41,13.8 v40,13 | 15.1,21.95 15.1,23.5 v16.4,23.5 | T2.1 14.02,17.32 | R57.2 v6.3,10.5 R58.2 | R59.2 v6.3,13.4 | 33.75,40.45 v35,41.7 | 53.99,23.01 v55.9,23 | D2.2 D2.3 46.01,32.89 v45.5,33.4 | v23,47 23,45.35 R56.1 | v45,12.6 C12.2 | C17.2 v52.79,23.01 | 33.75,24.2 v38.2,24.2 | C21.2 40.7,25 | 19.1,39.9 19.1,38.55 v19.6,38.05 | C22.2 49.49,24.99 v49.9,24.6 | v60.3,19.8 60.6,19 61.9,19 61.9,19.01 C13.2 | C11.2 35.51,14.01 v34.4,13
  Route3 0.406: v38.2,24.2 39.9,24.2 v40.7,24.9 | v56,17.6 60.28,17.6 60.28,19.8 v60.3,19.8
  Bottom 0.254: 35,43.04 T11.2 | 37,44.9 36.94,44.9 | 36.8,45 36.94,44.9 | 36.94,44.9 T13.2 | R52.2 | 37,46.02 37,46 | R42.2 | T7.2
  Bottom 0.406: v35,41.7 35,43.04 | T11.2 35.02,43.72 37,44.2 37,44.9 | R47.2 v43.5,46.2 | R52.2 v40.7,46.2 | T13.2 37,46.02 | R42.2 v8,51.5 | R37.2 9.5,49.95 v9.5,51.5 | T7.2 12.9,49.94 v12.9,51.5 | T9.2 3,49.94 3,51.9 6.1,51.9 v6.2,52 | v37,46.1 37,46 37,45.1
  pour Route3: 5,52.5 47,52.5 47,37 72.5,37 72.5,26.4 67.5,26.4 67.5,12 23.5,12 23.5,9.5 5,9.5
VSD_CARD  (via drill 0.3)
  Top 0.254: 47,34.04 D2.1
  Top 0.406: v56.3,36.1 56.3,40.25 C5.1 | C4.+ 47,36.1 | 47,36.1 47,34.04 | v48,36.1 47,36.1
  Route2 0.406: v48,36.1 v56.3,36.1 57.2,37.2 v62,37.2
  Bottom 0.254: T5.2 60.98,38.1 62,38.1
  Bottom 0.305: 62,38.1 v62,37.2
  Bottom 0.406: R25.2 T5.2

### Text on the board
Top: PL28012019 | BS
Route2: LY2
Route3: LY3
Bottom: PL28012019 | LS
tPlace: LOGGER
tNames: GND | RES | RESET | VDD | I2C_SCL | ALERT | ADDR | I2C_SDA | GND | PULS2 | GND | PULS1 | GND_US0 | RX_US0 | US0_TX | BATT_IN | BATT_GND | 1 | 1 | US1_ / RX | ADDR | ALERT | I2C_SCL | VDD | RESET | RES | GND | US1_TX | GND | I2C_SDA